# Altium project CONTROLLER_30.PrjPcb (part 2 of 3)

## Sheet PIC_POWER_MISC.SchDoc
size A3; ApprovedBy: D. Grossman; CheckedBy: G. Engel; Author: Y. Yakov; CompanyName: LightSense; DrawnBy: Y. Yakov; Engineer: Y.Yakov; Organization: LightSense
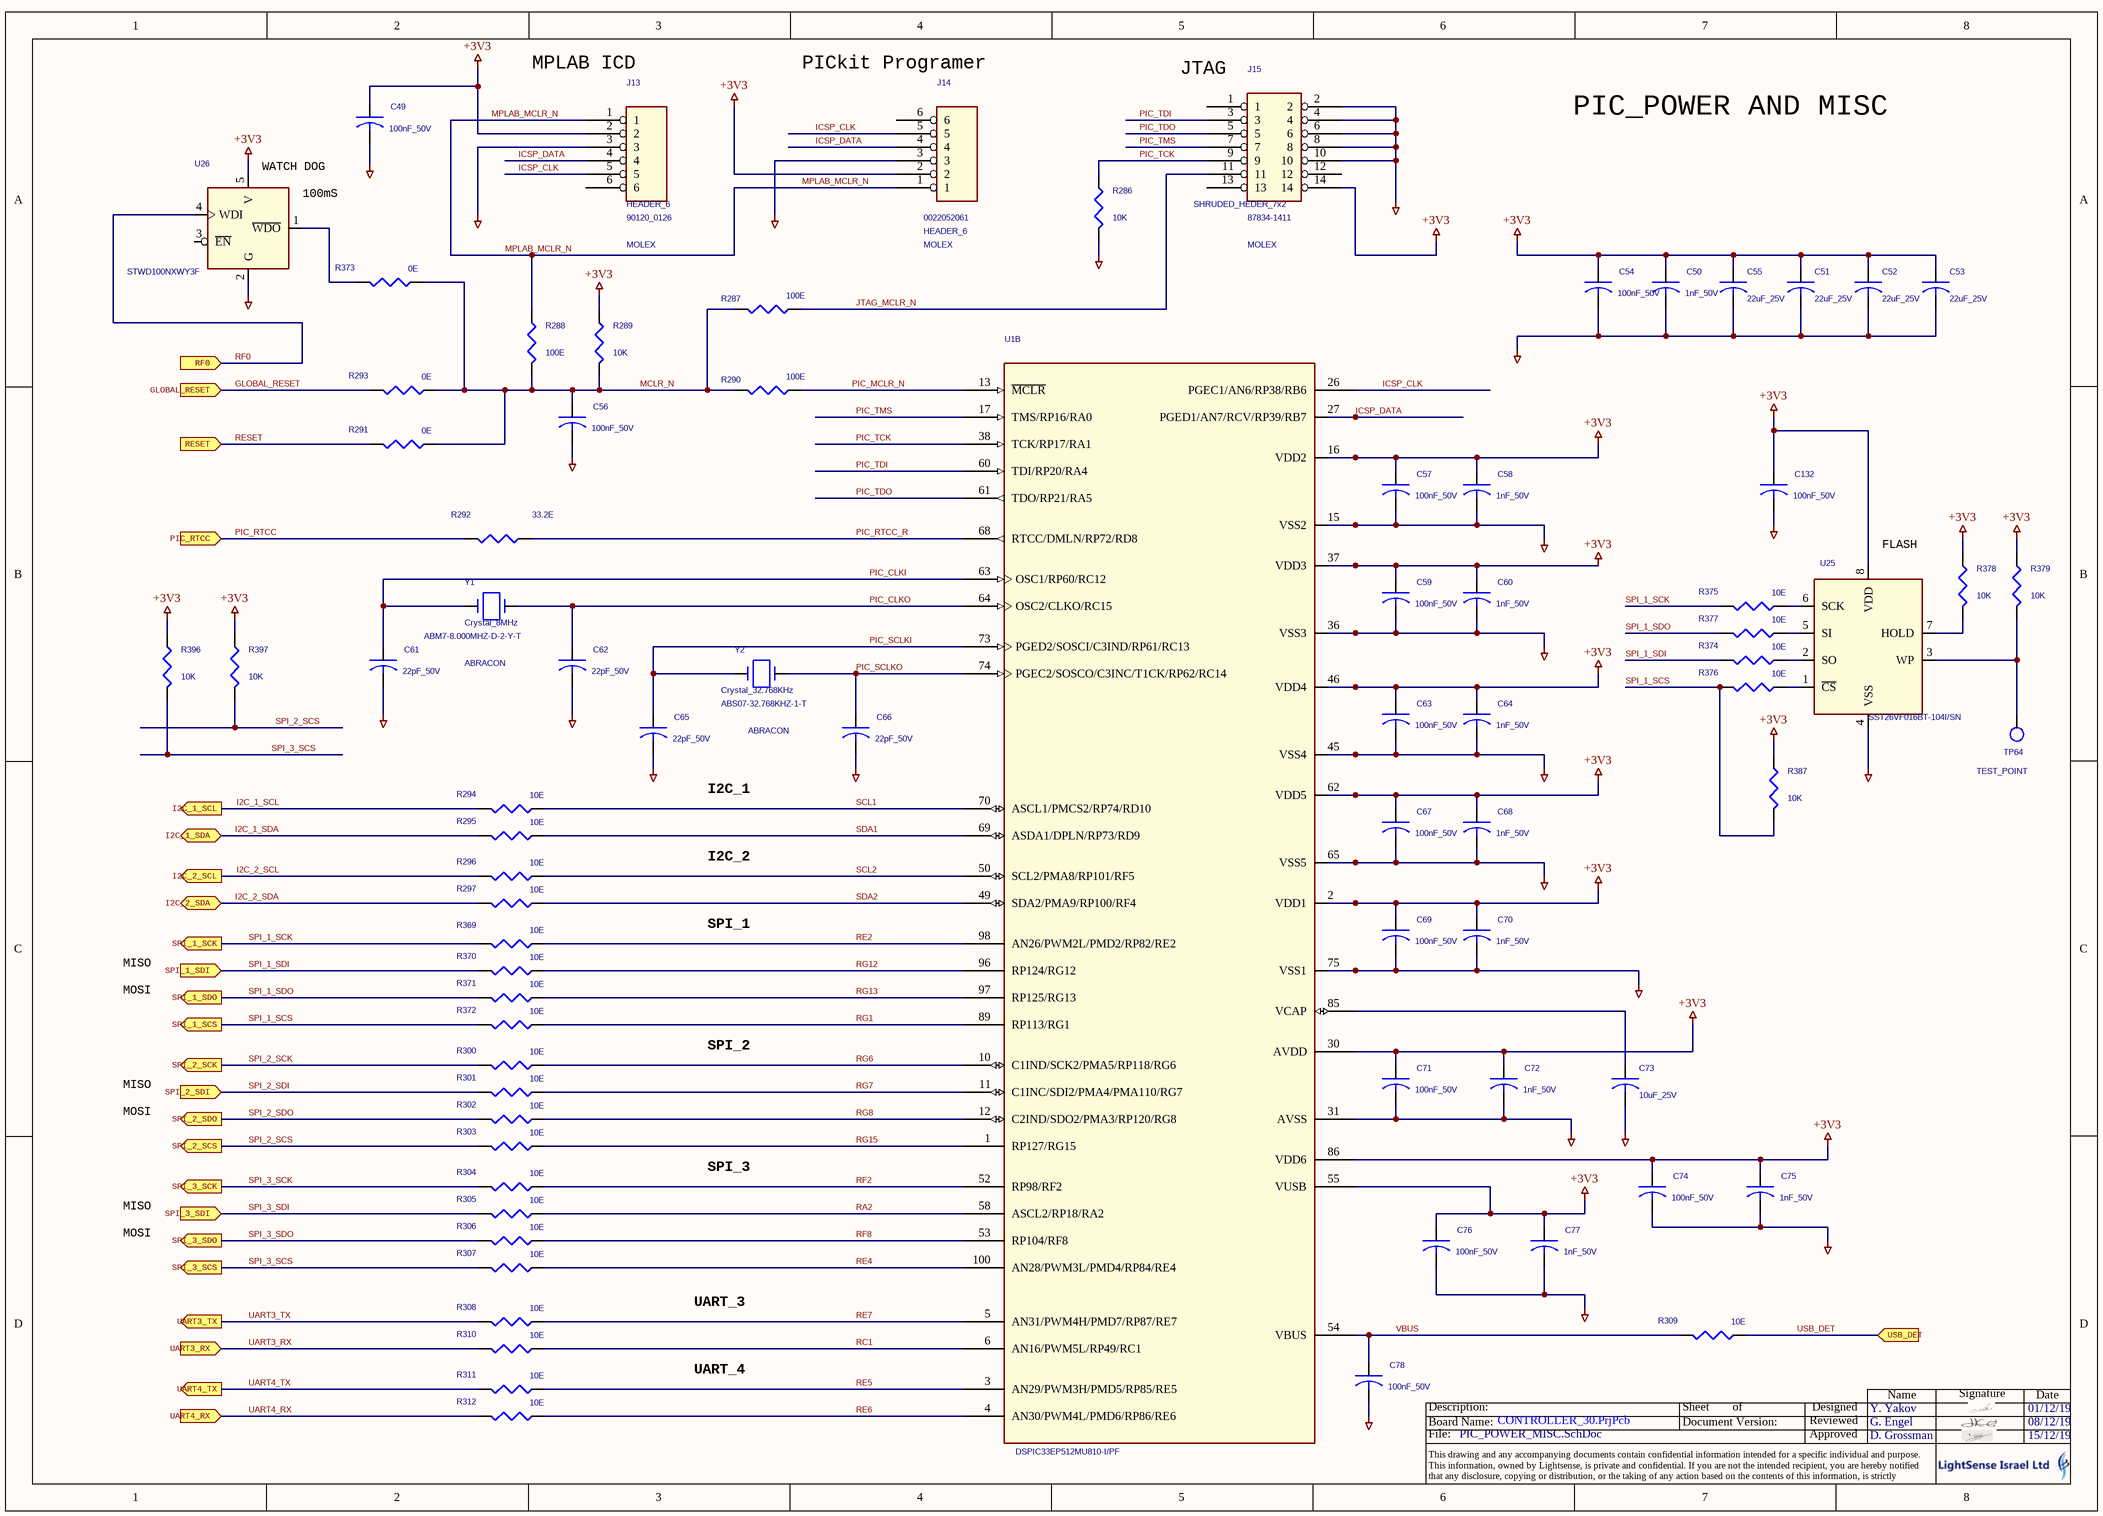
[diagram p13: PIC_POWER_MISC.SchDoc]

### Parts
C49  100nF_50V  [0603]
C50  1nF_50V  [0603]
C51  22uF_25V  [1210]
C52  22uF_25V  [1210]
C53  22uF_25V  [1210]
C54  100nF_50V  [0603]
C55  22uF_25V  [1210]
C56  100nF_50V  [0603]
C57  100nF_50V  [0603]
C58  1nF_50V  [0603]
C59  100nF_50V  [0603]
C60  1nF_50V  [0603]
C61  22pF_50V  [0603]
C62  22pF_50V  [0603]
C63  100nF_50V  [0603]
C64  1nF_50V  [0603]
C65  22pF_50V  [0603]
C66  22pF_50V  [0603]
C67  100nF_50V  [0603]
C68  1nF_50V  [0603]
C69  100nF_50V  [0603]
C70  1nF_50V  [0603]
C71  100nF_50V  [0603]
C72  1nF_50V  [0603]
C73  10uF_25V  [1206]
C74  100nF_50V  [0603]
C75  1nF_50V  [0603]
C76  100nF_50V  [0603]
C77  1nF_50V  [0603]
C78  100nF_50V  [0603]
C132  100nF_50V  [0603]
J13  HEADER_6  MFG: MOLEX  MFG_PN: 90120_0126  [HEADER_6PIN_100mil]
J14  HEADER_6  MFG_PN: 0022052061  MFG: MOLEX  [HEADER_6PIN_100mil]
J15  SHRUDED_HEDER_7x2  MFG: MOLEX  MFG_PN: 87834-1411  [SH_HEAD_2x7PIN_100mil]
R286  10K  [0603]
R287  100E  [0603]
R288  100E  [0603]
R289  10K  [0603]
R290  100E  [0603]
R291  0E  [0603]
R292  33.2E  [0603]
R293  0E  [0603]
R294  10E  [0603]
R295  10E  [0603]
R296  10E  [0603]
R297  10E  [0603]
R300  10E  [0603]
R301  10E  [0603]
R302  10E  [0603]
R303  10E  [0603]
R304  10E  [0603]
R305  10E  [0603]
R306  10E  [0603]
R307  10E  [0603]
R308  10E  [0603]
R309  10E  [0603]
R310  10E  [0603]
R311  10E  [0603]
R312  10E  [0603]
R369  10E  [0603]
R370  10E  [0603]
R371  10E  [0603]
R372  10E  [0603]
R373  0E  [0603]
R374  10E  [0603]
R375  10E  [0603]
R376  10E  [0603]
R377  10E  [0603]
R378  10K  [0603]
R379  10K  [0603]
R387  10K  [0603]
R396  10K  [0603]
R397  10K  [0603]
TP64  TEST_POINT  [TH_1mm]
U1  DSPIC33EP512MU810-I/PF  [TQFP_100]  (part B of 2)
U25  SST26VF016BT-104I/SN  [SOIC_8]
U26  STWD100NXWY3F  [SOT_23_5]
Y1  Crystal_8MHz  MFG_PN: ABM7-8.000MHZ-D-2-Y-T  MFG: ABRACON  [ABM7_SMD_2PIN]
Y2  Crystal_32.768KHz  MFG: ABRACON  MFG_PN: ABS07-32.768KHZ-1-T  [ABS07_SMD_2PIN]

### Ports
GLOBAL_RESET (in), I2C_1_SCL (out), I2C_1_SDA (bidir), I2C_2_SCL (out), I2C_2_SDA (bidir), PIC_RTCC (in), RESET (in), RF0 (in), SPI_1_SCK (out), SPI_1_SCS (out), SPI_1_SDI (in), SPI_1_SDO (out), SPI_2_SCK (out), SPI_2_SCS (out), SPI_2_SDI (in), SPI_2_SDO (out), SPI_3_SCK (out), SPI_3_SCS (out), SPI_3_SDI (in), SPI_3_SDO (out), UART3_RX (in), UART3_TX (out), UART4_RX (in), UART4_TX (out), USB_DET (in)

### Nets
+3V3: C49.1 C50.1 C51.1 C52.1 C53.1 C54.1 C55.1 C57.1 C58.1 C59.1 C60.1 C63.1 C64.1 C67.1 C68.1 C69.1 C70.1 C71.1 C72.1 C74.1 C75.1 C76.1 C77.1 C132.1 J13.2 J14.2 J15.14 R289.1 R378.1 R379.1 R387.1 R396.1 R397.1 U1.2(VDD1) U1.16(VDD2) U1.30(AVDD) U1.37(VDD3) U1.46(VDD4) U1.55(VUSB) U1.62(VDD5) U1.86(VDD6) U25.8(VDD) U26.5(V)
GND_CPU: C49.2 C50.2 C51.2 C52.2 C53.2 C54.2 C55.2 C56.2 C57.2 C58.2 C59.2 C60.2 C61.2 C62.2 C63.2 C64.2 C65.2 C66.2 C67.2 C68.2 C69.2 C70.2 C71.2 C72.2 C73.2 C74.2 C75.2 C76.2 C77.2 C78.2 C132.2 J13.3 J14.3 J15.2 J15.4 J15.6 J15.8 J15.10 R286.2 U1.15(VSS2) U1.31(AVSS) U1.36(VSS3) U1.45(VSS4) U1.65(VSS5) U1.75(VSS1) U25.4(VSS) U26.2(G)
GLOBAL_RESET: R293.2 ; port GLOBAL_RESET
I2C_1_SCL: R294.2 ; port I2C_1_SCL
I2C_1_SDA: R295.2 ; port I2C_1_SDA
I2C_2_SCL: R296.2 ; port I2C_2_SCL
I2C_2_SDA: R297.2 ; port I2C_2_SDA
ICSP_CLK: J13.5 J14.5 U1.26(PGEC1/AN6/RP38/RB6)
ICSP_DATA: J13.4 J14.4 U1.27(PGED1/AN7/RCV/RP39/RB7)
JTAG_MCLR_N: J15.11 R287.1
MCLR_N: C56.1 R287.2 R288.2 R289.2 R290.2 R291.1 R293.1 R373.1
MPLAB_MCLR_N: J13.1 J14.1 R288.1
PIC_CLKI: C61.1 U1.63(OSC1/RP60/RC12) Y1.1
PIC_CLKO: C62.1 U1.64(OSC2/CLKO/RC15) Y1.2
PIC_MCLR_N: R290.1 U1.13(~{MCLR})
PIC_RTCC: R292.2 ; port PIC_RTCC
PIC_RTCC_R: R292.1 U1.68(RTCC/DMLN/RP72/RD8)
PIC_SCLKI: C65.1 U1.73(PGED2/SOSCI/C3IND/RP61/RC13) Y2.1
PIC_SCLKO: C66.1 U1.74(PGEC2/SOSCO/C3INC/T1CK/RP62/RC14) Y2.2
PIC_TCK: J15.9 R286.1 U1.38(TCK/RP17/RA1)
PIC_TDI: J15.3 U1.60(TDI/RP20/RA4)
PIC_TDO: J15.5 U1.61(TDO/RP21/RA5)
PIC_TMS: J15.7 U1.17(TMS/RP16/RA0)
RA2: R305.1 U1.58(ASCL2/RP18/RA2)
RC1: R310.1 U1.6(AN16/PWM5L/RP49/RC1)
RE2: R369.1 U1.98(AN26/PWM2L/PMD2/RP82/RE2)
RE4: R307.1 U1.100(AN28/PWM3L/PMD4/RP84/RE4)
RE5: R311.1 U1.3(AN29/PWM3H/PMD5/RP85/RE5)
RE6: R312.1 U1.4(AN30/PWM4L/PMD6/RP86/RE6)
RE7: R308.1 U1.5(AN31/PWM4H/PMD7/RP87/RE7)
RESET: R291.2 ; port RESET
RF0: U26.4(WDI) ; port RF0
RF2: R304.1 U1.52(RP98/RF2)
RF8: R306.1 U1.53(RP104/RF8)
RG1: R372.1 U1.89(RP113/RG1)
RG6: R300.1 U1.10(C1IND/SCK2/PMA5/RP118/RG6)
RG7: R301.1 U1.11(C1INC/SDI2/PMA4/PMA110/RG7)
RG8: R302.1 U1.12(C2IND/SDO2/PMA3/RP120/RG8)
RG12: R370.1 U1.96(RP124/RG12)
RG13: R371.1 U1.97(RP125/RG13)
RG15: R303.1 U1.1(RP127/RG15)
SCL1: R294.1 U1.70(ASCL1/PMCS2/RP74/RD10)
SCL2: R296.1 U1.50(SCL2/PMA8/RP101/RF5)
SDA1: R295.1 U1.69(ASDA1/DPLN/RP73/RD9)
SDA2: R297.1 U1.49(SDA2/PMA9/RP100/RF4)
SPI_1_SCK: R369.2 R375.2 ; port SPI_1_SCK
SPI_1_SCS: R372.2 R376.2 R387.2 ; port SPI_1_SCS
SPI_1_SDI: R370.2 R374.2 ; port SPI_1_SDI
SPI_1_SDO: R371.2 R377.2 ; port SPI_1_SDO
SPI_2_SCK: R300.2 ; port SPI_2_SCK
SPI_2_SCS: R303.2 R397.2 ; port SPI_2_SCS
SPI_2_SDI: R301.2 ; port SPI_2_SDI
SPI_2_SDO: R302.2 ; port SPI_2_SDO
SPI_3_SCK: R304.2 ; port SPI_3_SCK
SPI_3_SCS: R307.2 R396.2 ; port SPI_3_SCS
SPI_3_SDI: R305.2 ; port SPI_3_SDI
SPI_3_SDO: R306.2 ; port SPI_3_SDO
UART3_RX: R310.2 ; port UART3_RX
UART3_TX: R308.2 ; port UART3_TX
UART4_RX: R312.2 ; port UART4_RX
UART4_TX: R311.2 ; port UART4_TX
USB_DET: R309.1 ; port USB_DET
VBUS: C78.1 R309.2 U1.54(VBUS)
NetC73_1: C73.1 U1.85(VCAP)
NetR373_2: R373.2 U26.1(~{WDO})
NetR374_1: R374.1 U25.2(SO)
NetR375_1: R375.1 U25.6(SCK)
NetR376_1: R376.1 U25.1(~{CS})
NetR377_1: R377.1 U25.5(SI)
NetR378_2: R378.2 U25.7(HOLD)
NetR379_2: R379.2 TP64.1(TP) U25.3(WP)

Not connected (* = marked no-connect by the designer): J13 6; J14 6; J15 1 12 13; U26 3(~{EN})

### Notes on the sheet
- (near J13) MPLAB ICD
- (near J14) PICkit Programer
- (near J15) JTAG
- PIC_POWER AND MISC
- (near U26) WATCH DOG
- (near U26) 100mS
- (near U25) FLASH
- I2C_1
- I2C_2
- SPI_1
- MISO
- MOSI
- SPI_2
- SPI_3
- UART_3
- UART_4
- Name
- Signature
- Date
- File:
- Board Name:
- Description:
- Document Version:
- Sheet
- of
- Approved
- Reviewed
- Designed
- This drawing and any accompanying documents contain confidential information intended for a specific individual and purpose.
  This information, owned by Lightsense, is private and confidential. If you are not the intended recipient, you are hereby notified that any disclosure, copying or distribution, or the taking of any action based on the contents of this information, is strictly prohibited.

### Library data of the parts
C49 C56 C57 C59 C63 C67 C69 C74 C78 C132 = C: as C113 on sheet USB
C50 C72 C77 = C: CAP_SMT_0603_50V_X7R_10%; MFG_PN: C0603C102K5RAC; MFG: KEMET
C51 C52 C55 = C: CAP_SMT_1210_25V_X7R_10%; MFG_PN: C1210C226K3RAC; MFG: KEMET
C53 = C: CAP_SMT_1210_25V_X7R_10%; MFG: KEMET; MFG_PN: C1210C226K3RAC
C54 C71 C76 = C: as C114 on sheet USB
C58 C60 C64 C68 C70 C75 = C: CAP_SMT_0603_50V_X7R_10%; MFG: KEMET; MFG_PN: C0603C102K5RAC
C61 C65 C66 = C: CAP_SMT_0603_50V_COG_10%; MFG: KEMET; MFG_PN: C0603C220K5GACTU
C62 = C: CAP_SMT_0603_50V_COG_10%; MFG_PN: C0603C220K5GACTU; MFG: KEMET
C73 = C: CAP_SMT_1206_25V_X7R_10%; MFG: KEMET; MFG_PN: C1206C106K3RAC
J13 J14 = HEADER 6
J15 = HEDER_7x2
R286 R378 R379 R387 R396 R397 = R_Dup1: MFG: YAGEO; MFG_PN: RC0603FR-0710K0L
R287 R288 R290 = R_Dup1: MFG: YAGEO; MFG_PN: RC0603FR-07100RL
R289 = R_Dup1: MFG_PN: RC0603FR-0710K0L; MFG: YAGEO
R291 R373 = R_Dup1: MFG_PN: RC0603FR-070R00L; MFG: YAGEO
R292 = R_Dup1: MFG: YAGEO; MFG_PN: RC0603FR-0733R2L
R293 = R_Dup1: MFG: YAGEO; MFG_PN: RC0603FR-070R00L
R294-R297 R300-R307 R309 R311 R312 R370-R372 R374 R376 R377 = R_Dup1: MFG: YAGEO; MFG_PN: RC0603FR-0710R0L
R308 R310 R369 R375 = R_Dup1: MFG_PN: RC0603FR-0710R0L; MFG: YAGEO
TP64 = T POINT R_Dup1
U1 = DSPIC33EP512MU810-I/PF_0: MFG: MICROCHIP; MFG_PN: DSPIC33EP512MU810-I/PF
U25 = SST26VF016BT-104I/SN: MFG: MICROCHIP; MFG_PN: SST26VF016BT-104I/SN
U26 = STWD100NXWY3F: WATCHDOG_100ms_SOT_23_5; MFG: ST; MFG_PN: STWD100NXWY3F
Y1 Y2 = Quartz

## Sheet ANALOG_INPUT.SchDoc
size A3; ApprovedBy: D. Grossman; CheckedBy: G. Engel; Author: Y. Yakov; CompanyName: LightSense; DrawnBy: Y. Yakov; Engineer: Y.Yakov; Organization: LightSense
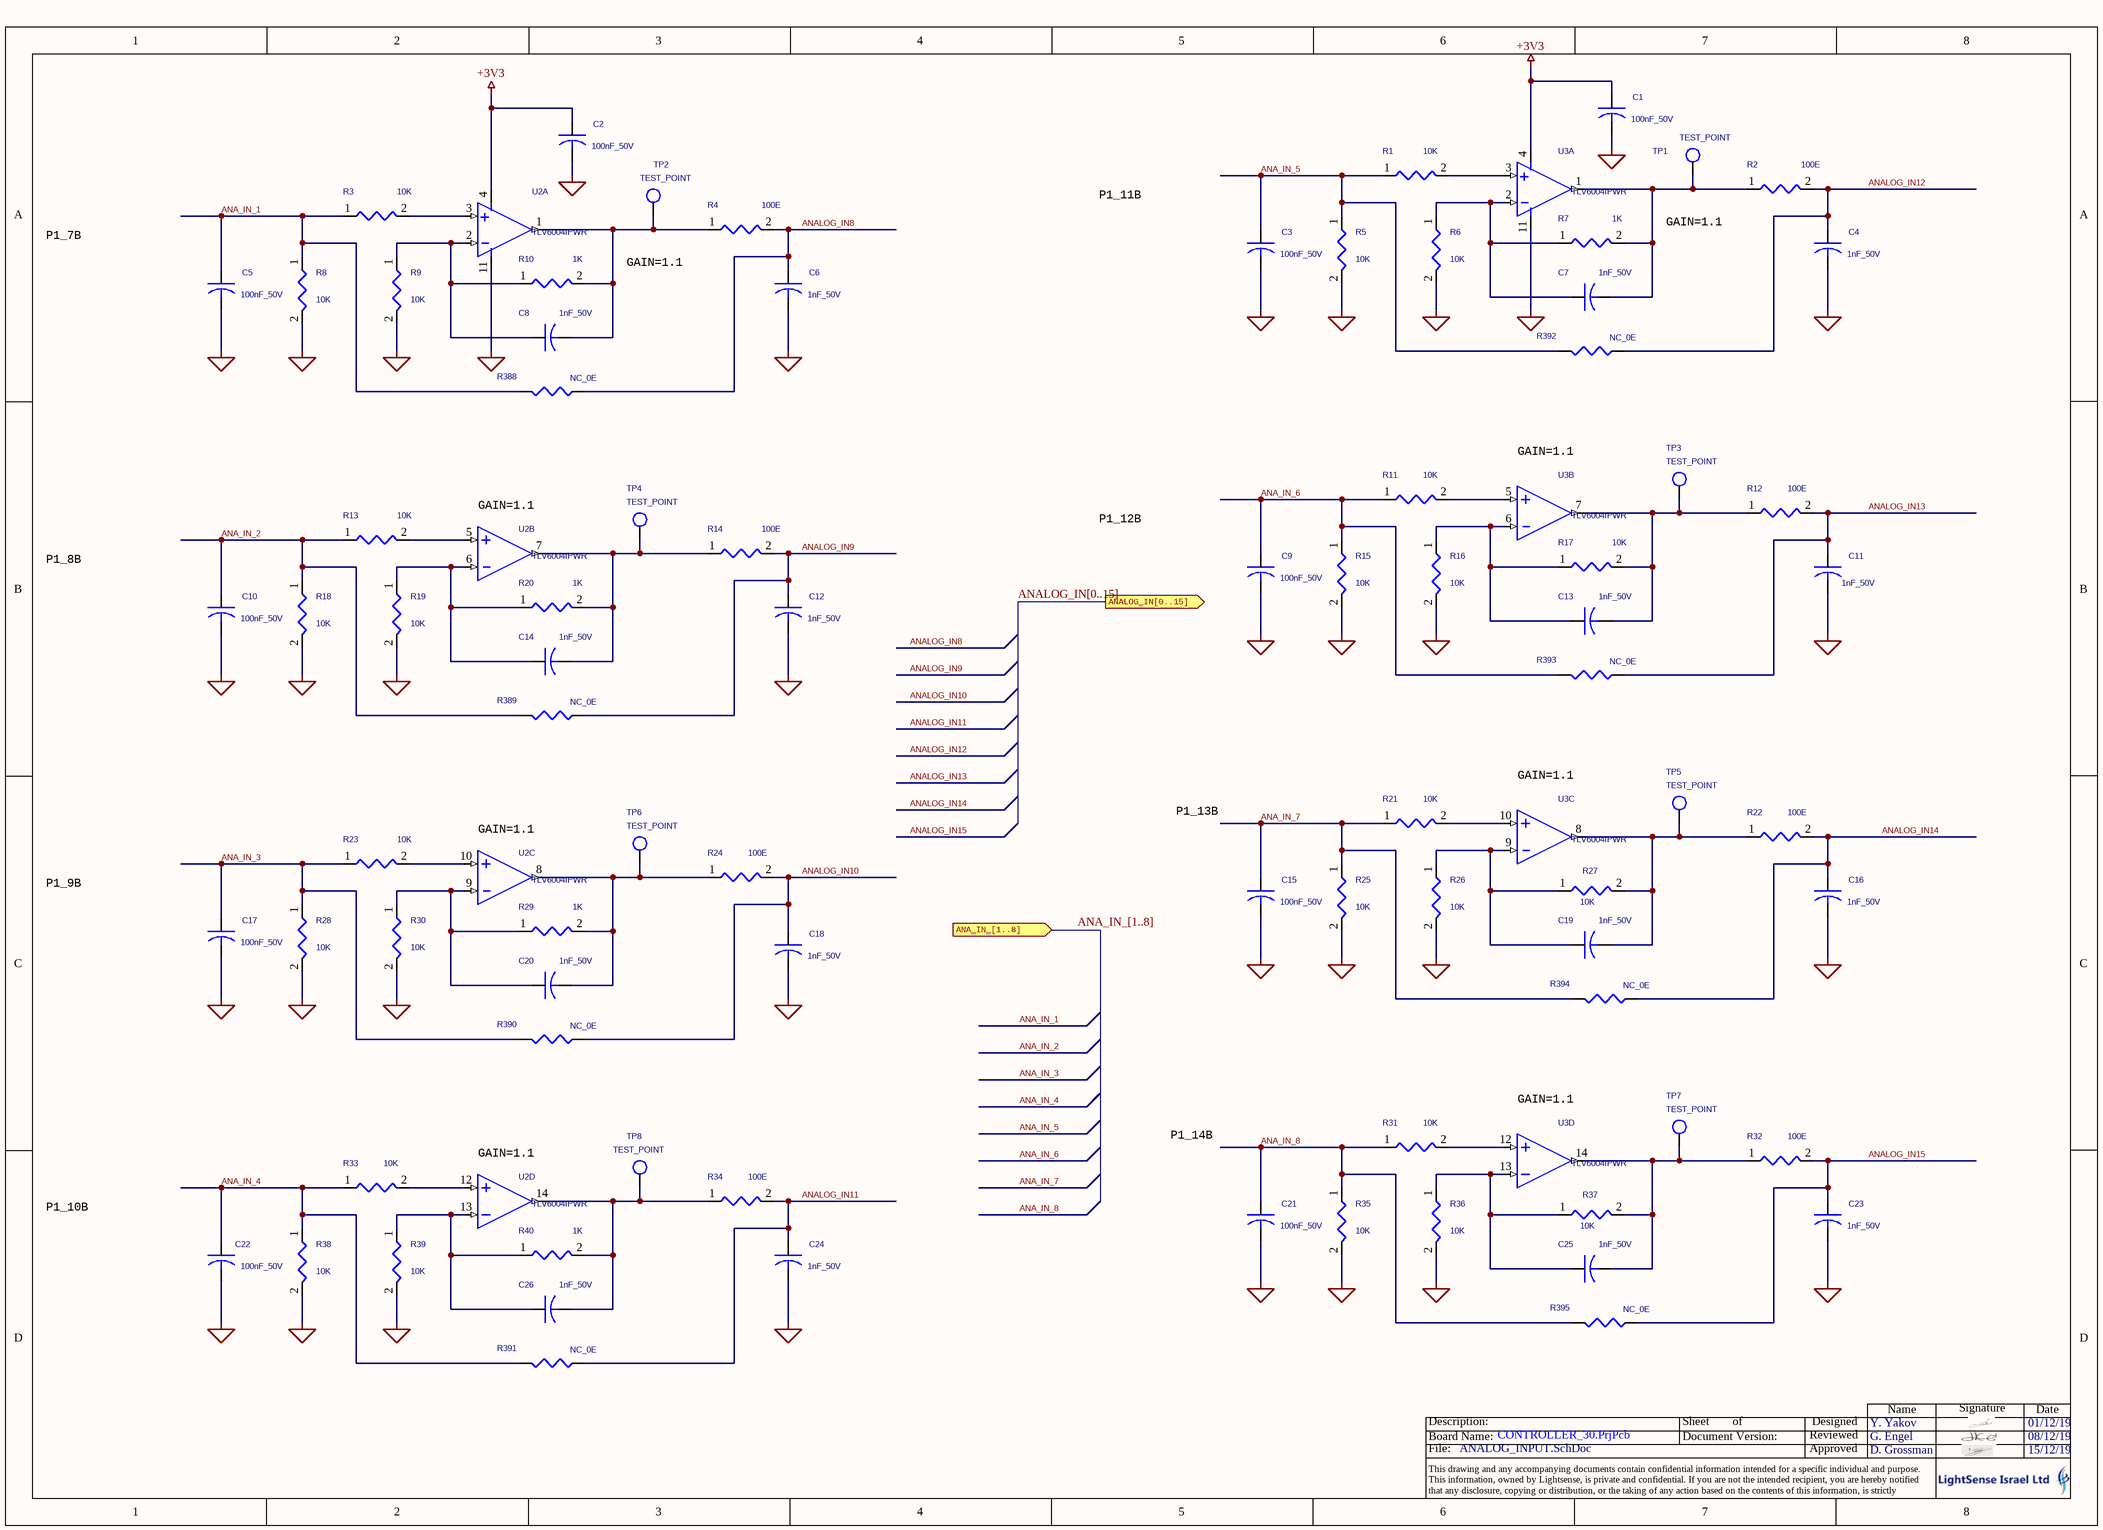
[diagram p14: ANALOG_INPUT.SchDoc]

### Parts
C1  100nF_50V  [0603]
C2  100nF_50V  [0603]
C3  100nF_50V  [0603]
C4  1nF_50V  [0603]
C5  100nF_50V  [0603]
C6  1nF_50V  [0603]
C7  1nF_50V  [0603]
C8  1nF_50V  [0603]
C9  100nF_50V  [0603]
C10  100nF_50V  [0603]
C11  1nF_50V  [0603]
C12  1nF_50V  [0603]
C13  1nF_50V  [0603]
C14  1nF_50V  [0603]
C15  100nF_50V  [0603]
C16  1nF_50V  [0603]
C17  100nF_50V  [0603]
C18  1nF_50V  [0603]
C19  1nF_50V  [0603]
C20  1nF_50V  [0603]
C21  100nF_50V  [0603]
C22  100nF_50V  [0603]
C23  1nF_50V  [0603]
C24  1nF_50V  [0603]
C25  1nF_50V  [0603]
C26  1nF_50V  [0603]
R1  10K  [0603]
R2  100E  [0603]
R3  10K  [0603]
R4  100E  [0603]
R5  10K  [0603]
R6  10K  [0603]
R7  1K  [0603]
R8  10K  [0603]
R9  10K  [0603]
R10  1K  [0603]
R11  10K  [0603]
R12  100E  [0603]
R13  10K  [0603]
R14  100E  [0603]
R15  10K  [0603]
R16  10K  [0603]
R17  10K  [0603]
R18  10K  [0603]
R19  10K  [0603]
R20  1K  [0603]
R21  10K  [0603]
R22  100E  [0603]
R23  10K  [0603]
R24  100E  [0603]
R25  10K  [0603]
R26  10K  [0603]
R27  10K  [0603]
R28  10K  [0603]
R29  1K  [0603]
R30  10K  [0603]
R31  10K  [0603]
R32  100E  [0603]
R33  10K  [0603]
R34  100E  [0603]
R35  10K  [0603]
R36  10K  [0603]
R37  10K  [0603]
R38  10K  [0603]
R39  10K  [0603]
R40  1K  [0603]
R388  NC_0E  [0603]
R389  NC_0E  [0603]
R390  NC_0E  [0603]
R391  NC_0E  [0603]
R392  NC_0E  [0603]
R393  NC_0E  [0603]
R394  NC_0E  [0603]
R395  NC_0E  [0603]
TP1  TEST_POINT  [TH_1mm]
TP2  TEST_POINT  [TH_1mm]
TP3  TEST_POINT  [TH_1mm]
TP4  TEST_POINT  [TH_1mm]
TP5  TEST_POINT  [TH_1mm]
TP6  TEST_POINT  [TH_1mm]
TP7  TEST_POINT  [TH_1mm]
TP8  TEST_POINT  [TH_1mm]
U2  TLV6004IPWR  [TSSOP_14]  (parts A,B,C,D of 4)
U3  TLV6004IPWR  [TSSOP_14]  (parts A,B,C,D of 4)

### Ports
ANA_IN_[1..8] (in), ANALOG_IN[0..15] (out)

### Nets
+3V3: C1.1 C2.1 U2.4(VCC) U3.4(VCC)
AGND: C1.2 C2.2 C3.2 C4.2 C5.2 C6.2 C9.2 C10.2 C11.2 C12.2 C15.2 C16.2 C17.2 C18.2 C21.2 C22.2 C23.2 C24.2 R5.2 R6.2 R8.2 R9.2 R15.2 R16.2 R18.2 R19.2 R25.2 R26.2 R28.2 R30.2 R35.2 R36.2 R38.2 R39.2 U2.11(VEE) U3.11(VEE)
ANA_IN_1: C5.1 R3.1 R8.1 R388.2
ANA_IN_2: C10.1 R13.1 R18.1 R389.2
ANA_IN_3: C17.1 R23.1 R28.1 R390.2
ANA_IN_4: C22.1 R33.1 R38.1 R391.2
ANA_IN_5: C3.1 R1.1 R5.1 R392.2
ANA_IN_6: C9.1 R11.1 R15.1 R393.2
ANA_IN_7: C15.1 R21.1 R25.1 R394.2
ANA_IN_8: C21.1 R31.1 R35.1 R395.2
ANALOG_IN8: C6.1 R4.2 R388.1
ANALOG_IN9: C12.1 R14.2 R389.1
ANALOG_IN10: C18.1 R24.2 R390.1
ANALOG_IN11: C24.1 R34.2 R391.1
ANALOG_IN12: C4.1 R2.2 R392.1
ANALOG_IN13: C11.1 R12.2 R393.1
ANALOG_IN14: C16.1 R22.2 R394.1
ANALOG_IN15: C23.1 R32.2 R395.1
NetC7_1: C7.1 R6.1 R7.1 U3.2(IAN)
NetC7_2: C7.2 R2.1 R7.2 TP1.1(TP) U3.1(OA)
NetC8_1: C8.1 R9.1 R10.1 U2.2(IAN)
NetC8_2: C8.2 R4.1 R10.2 TP2.1(TP) U2.1(OA)
NetC13_1: C13.1 R16.1 R17.1 U3.6(IBN)
NetC13_2: C13.2 R12.1 R17.2 TP3.1(TP) U3.7(OB)
NetC14_1: C14.1 R19.1 R20.1 U2.6(IBN)
NetC14_2: C14.2 R14.1 R20.2 TP4.1(TP) U2.7(OB)
NetC19_1: C19.1 R26.1 R27.1 U3.9(ICN)
NetC19_2: C19.2 R22.1 R27.2 TP5.1(TP) U3.8(OC)
NetC20_1: C20.1 R29.1 R30.1 U2.9(ICN)
NetC20_2: C20.2 R24.1 R29.2 TP6.1(TP) U2.8(OC)
NetC25_1: C25.1 R36.1 R37.1 U3.13(IDN)
NetC25_2: C25.2 R32.1 R37.2 TP7.1(TP) U3.14(OD)
NetC26_1: C26.1 R39.1 R40.1 U2.13(IDN)
NetC26_2: C26.2 R34.1 R40.2 TP8.1(TP) U2.14(OD)
NetR1_2: R1.2 U3.3(IAP)
NetR3_2: R3.2 U2.3(IAP)
NetR11_2: R11.2 U3.5(IBP)
NetR13_2: R13.2 U2.5(IBP)
NetR21_2: R21.2 U3.10(ICP)
NetR23_2: R23.2 U2.10(ICP)
NetR31_2: R31.2 U3.12(IDP)
NetR33_2: R33.2 U2.12(IDP)

### Buses and harness runs
bus ANA_IN_[1..8] = port ANA_IN_[1..8]
bus ANALOG_IN[0..15] = port ANALOG_IN[0..15]

### Notes on the sheet
- P1_11B
- P1_7B
- GAIN=1.1
- (near U3) GAIN=1.1
- (near U2) GAIN=1.1
- P1_12B
- P1_8B
- P1_13B
- P1_9B
- P1_14B
- P1_10B
- Name
- Signature
- Date
- File:
- Board Name:
- Description:
- Document Version:
- Sheet
- of
- Approved
- Reviewed
- Designed
- This drawing and any accompanying documents contain confidential information intended for a specific individual and purpose.
  This information, owned by Lightsense, is private and confidential. If you are not the intended recipient, you are hereby notified that any disclosure, copying or distribution, or the taking of any action based on the contents of this information, is strictly prohibited.

### Library data of the parts
C1 C5 C22 = C: CAP_SMT_0603_50V_X7R_10%; MFG: KEMET; MFG_PN: C0603C104K5RAC
C2 C3 C9 C10 C15 C17 C21 = C: CAP_SMT_0603_50V_X7R_10%; MFG_PN: C0603C104K5RAC; MFG: KEMET
C4 C6-C8 C12 C13 C16 C19 C20 C23-C25 = C: CAP_SMT_0603_50V_X7R_10%; MFG: KEMET; MFG_PN: C0603C102K5RAC
C11 C14 C18 C26 = C: CAP_SMT_0603_50V_X7R_10%; MFG_PN: C0603C102K5RAC; MFG: KEMET
R1-R26 R28-R36 R38-R40 = R_Dup2: MFG: YAGEO; MFG_PN: RC0603FR-07  KL
R27 R37 = R_Dup2: MFG_PN: RC0603FR-07  KL; MFG: YAGEO
R388 R390 R391 R394 R395 = R_Dup1: MFG_PN: RC0603FR-070R00L; MFG: YAGEO
R389 R392 R393 = R_Dup1: MFG: YAGEO; MFG_PN: RC0603FR-070R00L
TP1-TP8 = T POINT R_Dup1
U2 U3 = TL6004IP: OP_AMP; MFG: TI; MFG_PN: TLV6004IPWR

## Sheet POWER.SchDoc
size A3; ApprovedBy: D. Grossman; CheckedBy: G. Engel; Author: Y. Yakov; CompanyName: LightSense; DrawnBy: Y. Yakov; Engineer: Y.Yakov; Organization: LightSense
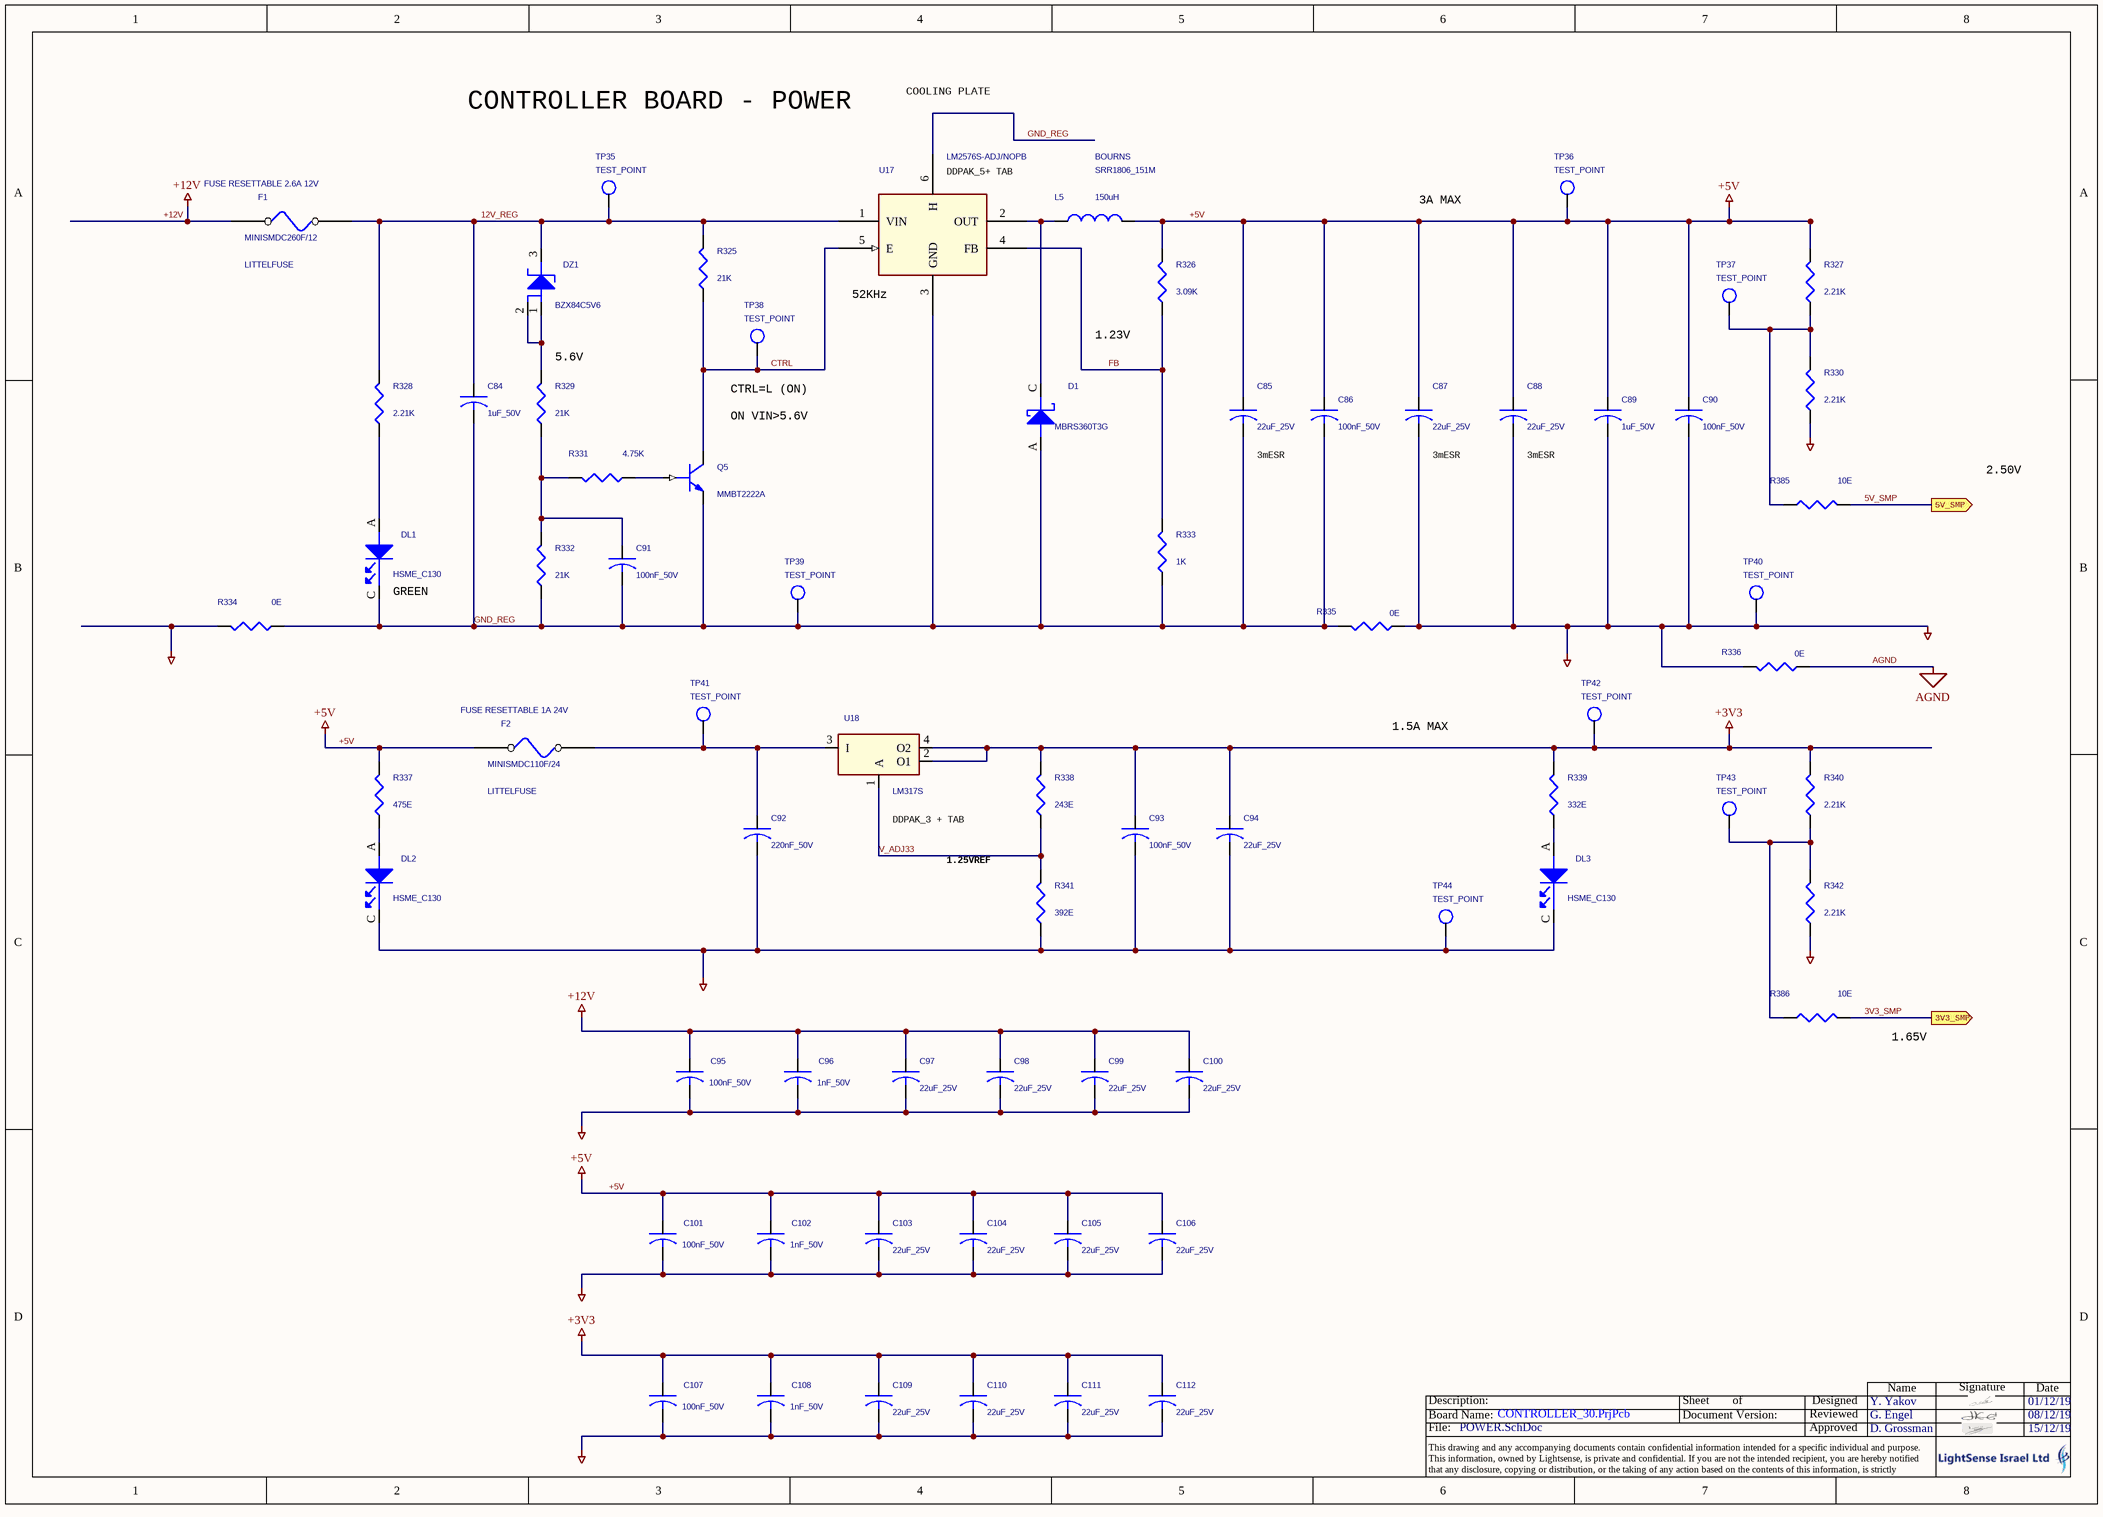
[diagram p15: POWER.SchDoc]

### Parts
C84  1uF_50V  [0805]
C85  22uF_25V  [1812]
C86  100nF_50V  [0603]
C87  22uF_25V  [1812]
C88  22uF_25V  [1812]
C89  1uF_50V  [0805]
C90  100nF_50V  [0603]
C91  100nF_50V  [0603]
C92  220nF_50V  [0603]
C93  100nF_50V  [0603]
C94  22uF_25V  [1210]
C95  100nF_50V  [0603]
C96  1nF_50V  [0603]
C97  22uF_25V  [1210]
C98  22uF_25V  [1210]
C99  22uF_25V  [1210]
C100  22uF_25V  [1210]
C101  100nF_50V  [0603]
C102  1nF_50V  [0603]
C103  22uF_25V  [1210]
C104  22uF_25V  [1210]
C105  22uF_25V  [1210]
C106  22uF_25V  [1210]
C107  100nF_50V  [0603]
C108  1nF_50V  [0603]
C109  22uF_25V  [1210]
C110  22uF_25V  [1210]
C111  22uF_25V  [1210]
C112  22uF_25V  [1210]
D1  MBRS360T3G  [SMC]
DL1  HSME_C130  [LED_0603]
DL2  HSME_C130  [LED_0603]
DL3  HSME_C130  [LED_0603]
DZ1  BZX84C5V6  [SOT_23]
F1  FUSE RESETTABLE 2.6A 12V  MFG: LITTELFUSE  MFG_PN: MINISMDC260F/12  [F1812]
F2  FUSE RESETTABLE 1A 24V  MFG_PN: MINISMDC110F/24  MFG: LITTELFUSE  [F1812]
L5  150uH  MFG: BOURNS  MFG_PN: SRR1806_151M  [SRR1806]
Q5  MMBT2222A  [SOT_23]
R325  21K  [0603]
R326  3.09K  [0603]
R327  2.21K  [0603]
R328  2.21K  [0603]
R329  21K  [0603]
R330  2.21K  [0603]
R331  4.75K  [0603]
R332  21K  [0603]
R333  1K  [0603]
R334  0E  [1812]
R335  0E  [1812]
R336  0E  [0805]
R337  475E  [0603]
R338  243E  [0603]
R339  332E  [0603]
R340  2.21K  [0603]
R341  392E  [0603]
R342  2.21K  [0603]
R385  10E  [0603]
R386  10E  [0603]
TP35  TEST_POINT  [TH_1mm]
TP36  TEST_POINT  [TH_1mm]
TP37  TEST_POINT  [TH_1mm]
TP38  TEST_POINT  [TH_1mm]
TP39  TEST_POINT  [TH_1mm]
TP40  TEST_POINT  [TH_1mm]
TP41  TEST_POINT  [TH_1mm]
TP42  TEST_POINT  [TH_1mm]
TP43  TEST_POINT  [TH_1mm]
TP44  TEST_POINT  [TH_1mm]
U17  LM2576S-ADJ/NOPB  [TO_263_6]
U18  LM317S  [TO_263_4]

### Ports
3V3_SMP (out), 5V_SMP (out)

### Nets
+3V3: C93.1 C94.1 C107.1 C108.1 C109.1 C110.1 C111.1 C112.1 R338.2 R339.2 R340.2 TP42.1(TP) U18.2(O1) U18.4(O2)
+5V: C85.1 C86.1 C87.1 C88.1 C89.1 C90.1 C101.1 C102.1 C103.1 C104.1 C105.1 C106.1 F2.1 L5.2 R326.2 R327.2 R337.2 TP36.1(TP)
+12V: C95.1 C96.1 C97.1 C98.1 C99.1 C100.1 F1.1
AGND: R336.1
GND_CPU: C87.2 C88.2 C89.2 C90.2 C92.2 C93.2 C94.2 C101.2 C102.2 C103.2 C104.2 C105.2 C106.2 C107.2 C108.2 C109.2 C110.2 C111.2 C112.2 DL2.C(CATHODE) DL3.C(CATHODE) R330.1 R335.1 R336.2 R341.1 R342.1 TP40.1(TP) TP44.1(TP)
GND_M: C95.2 C96.2 C97.2 C98.2 C99.2 C100.2 R334.2
3V3_SMP: R386.2 ; port 3V3_SMP
5V_SMP: R385.2 ; port 5V_SMP
12V_REG: C84.1 DZ1.3(CATHODE) F1.2 R325.2 R328.2 TP35.1(TP) U17.1(VIN)
CTRL: Q5.3(COLLECTOR) R325.1 TP38.1(TP) U17.5(E)
FB: R326.1 R333.2 U17.4(FB)
GND_REG: C84.2 C85.2 C86.2 C91.2 D1.A DL1.C(CATHODE) Q5.2(EMITTER) R332.1 R333.1 R334.1 R335.2 TP39.1(TP) U17.3(GND) U17.6(H)
V_ADJ33: R338.1 R341.2 U18.1(A)
NetC91_1: C91.1 R329.1 R331.2 R332.2
NetC92_1: C92.1 F2.2 TP41.1(TP) U18.3(I)
NetD1_C: D1.C L5.1 U17.2(OUT)
NetDL1_A: DL1.A(ANODE) R328.1
NetDL2_A: DL2.A(ANODE) R337.1
NetDL3_A: DL3.A(ANODE) R339.1
NetDZ1_1: DZ1.1(ANODE_1) DZ1.2(Anode_2) R329.2
NetQ5_1: Q5.1(BASE) R331.1
NetR327_1: R327.1 R330.2 R385.1 TP37.1(TP)
NetR340_1: R340.1 R342.2 R386.1 TP43.1(TP)

### Notes on the sheet
- CONTROLLER BOARD - POWER
- COOLING PLATE
- (near U17) DDPAK_5+ TAB
- 3A MAX
- (near U17) 52KHz
- (near R329) 5.6V
- (near R326) 1.23V
- (near TP38) CTRL=L (ON)
- ON VIN>5.6V
- (near C85) 3mESR
- (near C87) 3mESR
- (near C88) 3mESR
- 2.50V
- (near DL1) GREEN
- 1.5A MAX
- (near U18) DDPAK_3 + TAB
- 1.25VREF
- 1.65V
- Name
- Signature
- Date
- File:
- Board Name:
- Description:
- Document Version:
- Sheet
- of
- Approved
- Reviewed
- Designed
- This drawing and any accompanying documents contain confidential information intended for a specific individual and purpose.
  This information, owned by Lightsense, is private and confidential. If you are not the intended recipient, you are hereby notified that any disclosure, copying or distribution, or the taking of any action based on the contents of this information, is strictly prohibited.

### Library data of the parts
C84 C89 = CAP: a; Mnfctr_Part_Number: TCJT106M016R0150; MFG: Murata; MFG_PN: GRM21BR60J106K
C85 C87 C88 = CAP: a; MFG: TDK; MFG_PN: C4532X7R1E226M
C86 C101 C107 = C: as C2 on sheet ANALOG_INPUT
C90 C91 C93 C95 = C: as C1 on sheet ANALOG_INPUT
C92 = C: CAP_SMT_0603_50V_X7R_10%; MFG: TDK; MFG_PN: C1608X7R1H224K080AB
C94 C97-C100 C104-C106 C109 C110 C112 = C: CAP_SMT_1210_25V_X7R_10%; MFG_PN: C1210C226K3RAC; MFG: KEMET
C96 = C: as C4 on sheet ANALOG_INPUT
C102 C108 = C: as C11 on sheet ANALOG_INPUT
C103 C111 = C: CAP_SMT_1210_25V_X7R_10%; MFG: KEMET; MFG_PN: C1210C226K3RAC
D1 = DIODE SCHOTTKY_2: MFG: ON; Lumenis_P/N: DE0000062; MFG_PN: MBRS360T3G
DL1 DL3 = LED: Lumenis_P/N: EL0000123; MFG: AVAGO; MFG_PN: HSME_C130
DL2 = LED: MFG: AVAGO; Lumenis_P/N: EL0000123; MFG_PN: HSME_C130
DZ1 = DIODE ZENER S23: MFG: DIODES; MFG_PN: BZX84C5V6
F1 F2 = FUSE: FUSE_2.6A_MINISMDC260F/12; P/N1: Littelfuse;0154005.DR
L5 = CHOKE
Q5 = MMBT2222A: MFG: ST; MFG_PN: MMBT2222A
R325 = R_Dup1: MFG_PN: RC0603FR-0721K0L; MFG: YAGEO
R326 = R_Dup1: MFG_PN: RC0603FR-073K09L; MFG: YAGEO
R327 R330 R340 = R_Dup1: MFG: YAGEO; MFG_PN: RC0603FR-072K21L
R328 R342 = R_Dup1: MFG_PN: RC0603FR-072K21L; MFG: YAGEO
R329 R332 = R_Dup1: MFG: YAGEO; MFG_PN: RC0603FR-0721K0L
R331 = R_Dup1: MFG: YAGEO; MFG_PN: RC0603FR-074K75L
R333 = R_Dup1: MFG: YAGEO; MFG_PN: RC0603FR-071K00L
R334 = R_Dup1: MFG_PN: CRCW25120000Z0EG; MFG: VISHAY
R335 = R_Dup1: MFG_PN: RC0603FR-070R00L; MFG: YAGEO
R336 = R_Dup1: MFG: YAGEO; MFG_PN: RC0603FR-070R00L
R337 = R_Dup1: MFG_PN: RC0603FR-07475EL; MFG: YAGEO
R338 = R_Dup1: MFG: YAGEO; MFG_PN: RC0603FR-07243RL
R339 = R_Dup1: MFG_PN: RC0603FR-07332RL; MFG: YAGEO
R341 = R_Dup1: MFG_PN: RC0603FR-07392RL; MFG: YAGEO
R385 R386 = R_Dup1: MFG: YAGEO; MFG_PN: RC0603FR-0710R0L
TP35-TP44 = T POINT R_Dup1
U17 = LM2576X/TO263_0: MFG: TI; MFG_PN: LM2576S-ADJ/NOPB
U18 = LM317EMP: MFG: NATIONAL; MFG_PN: LM317S

## Sheet I2C_CH2.SchDoc
size A3; ApprovedBy: D. Grossman; CheckedBy: G. Engel; Author: Y. Yakov; CompanyName: LightSense; DrawnBy: Y. Yakov; Engineer: Y.Yakov; Organization: LightSense
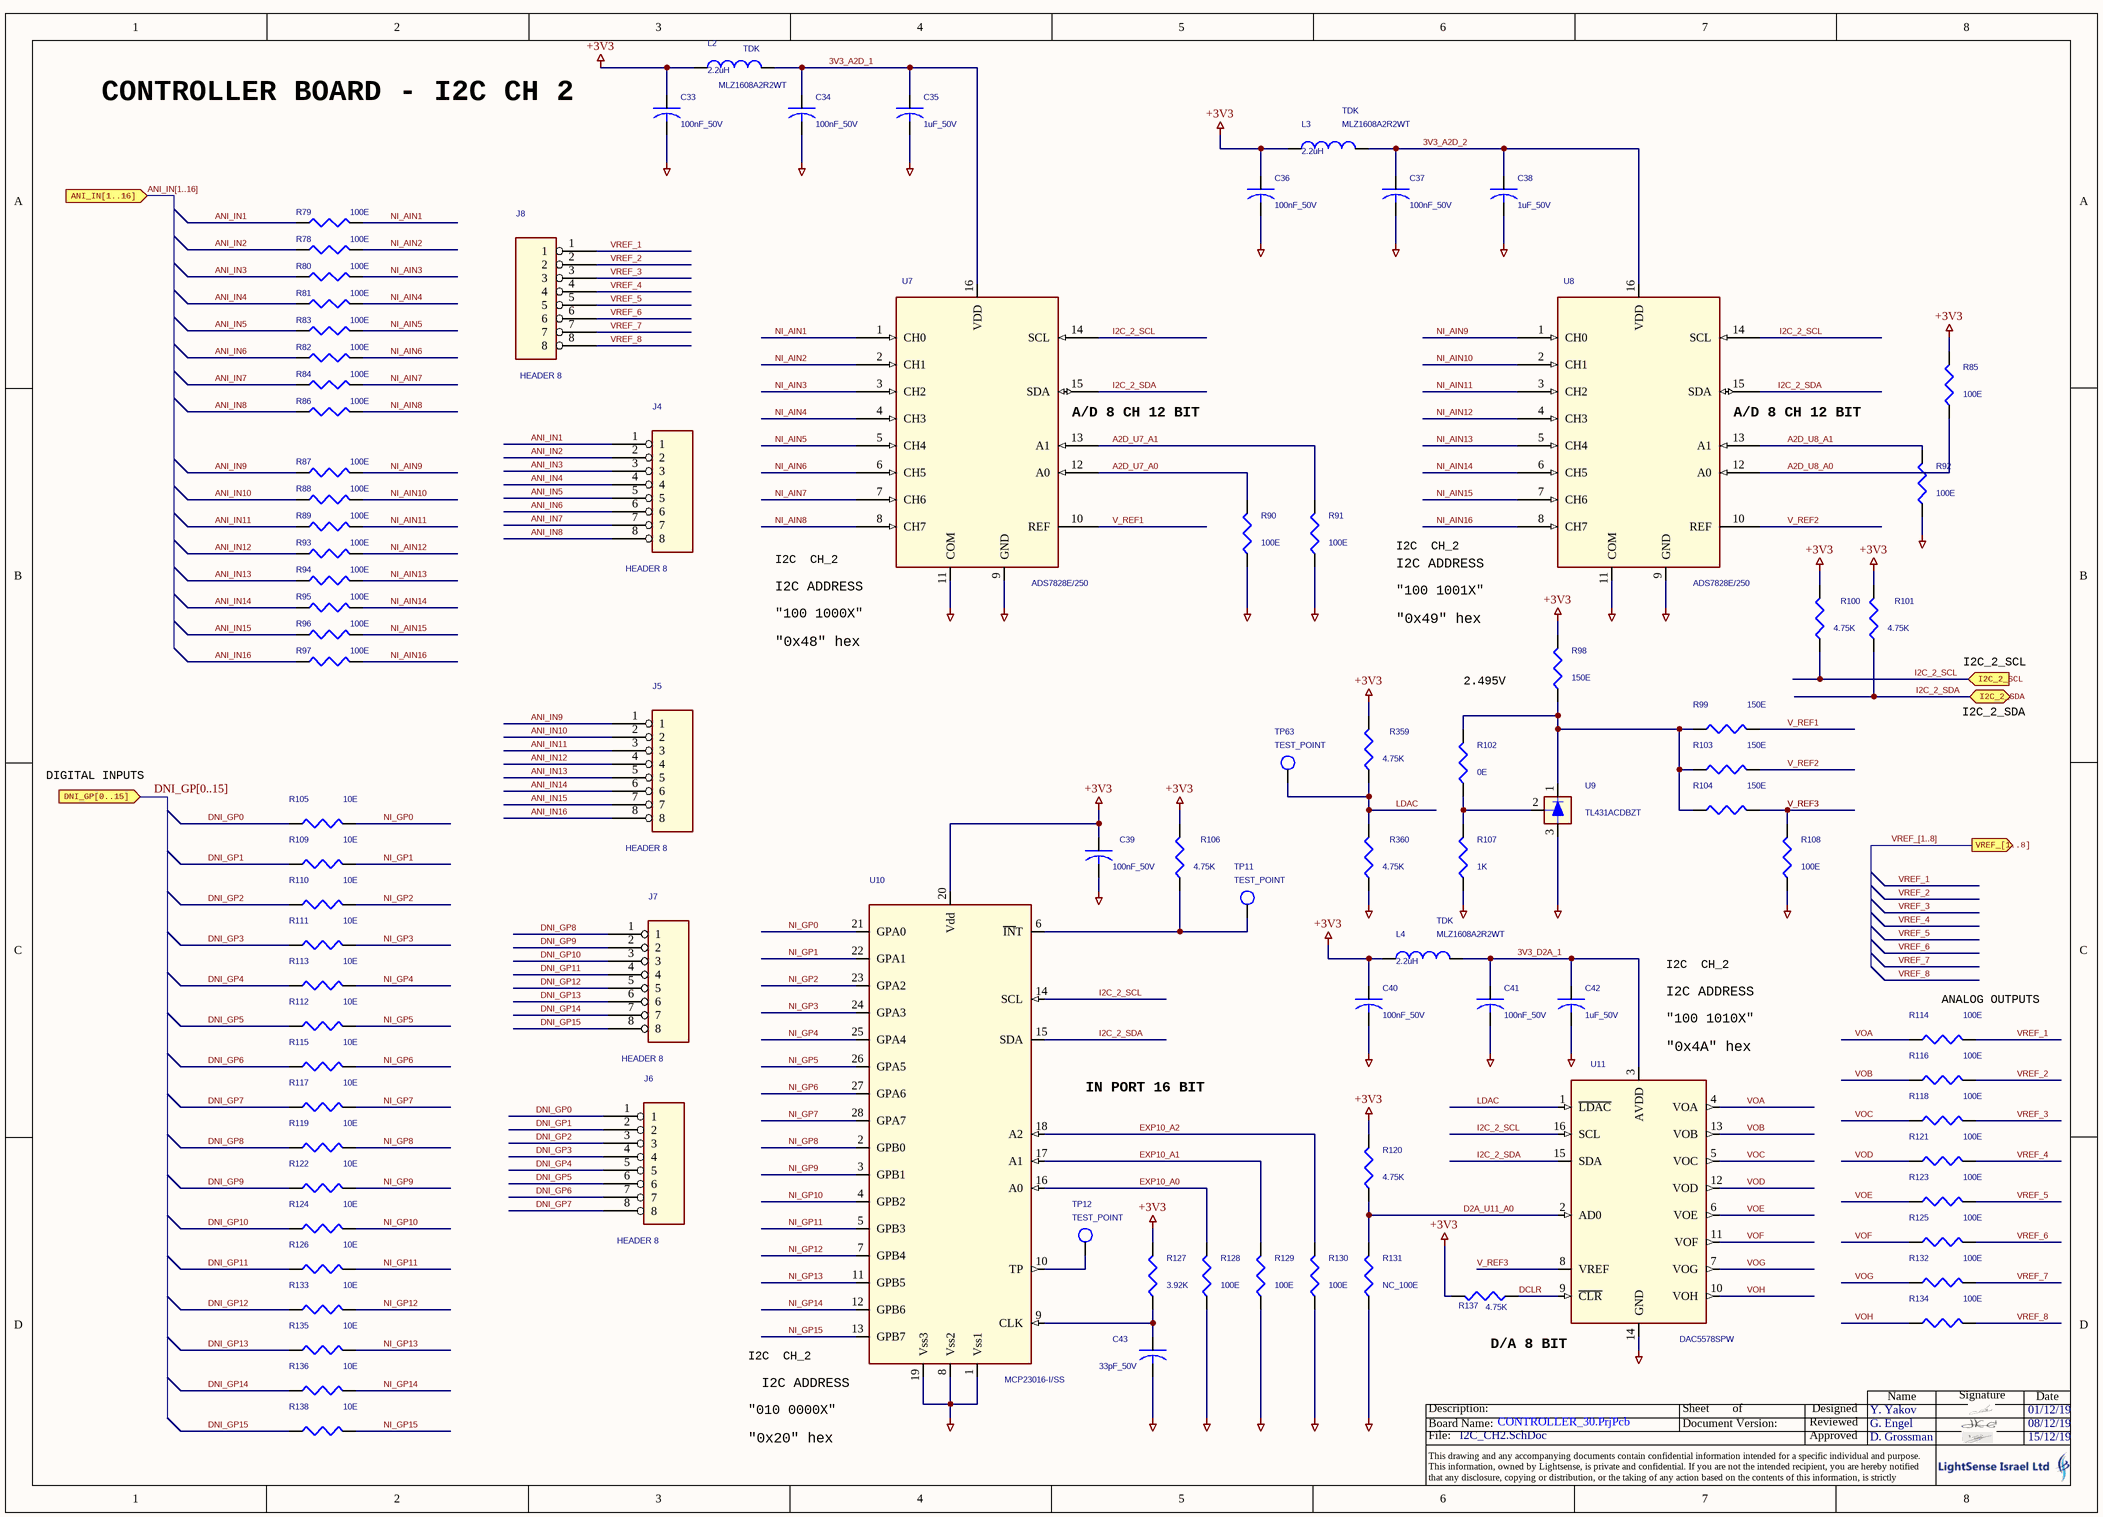
[diagram p16: I2C_CH2.SchDoc]

### Parts
C33  100nF_50V  [0603]
C34  100nF_50V  [0603]
C35  1uF_50V  [0805]
C36  100nF_50V  [0603]
C37  100nF_50V  [0603]
C38  1uF_50V  [0805]
C39  100nF_50V  [0603]
C40  100nF_50V  [0603]
C41  100nF_50V  [0603]
C42  1uF_50V  [0805]
C43  33pF_50V  [0603]
J4  HEADER 8  [TH_8PIN_100mil]
J5  HEADER 8  [TH_8PIN_100mil]
J6  HEADER 8  [TH_8PIN_100mil]
J7  HEADER 8  [TH_8PIN_100mil]
J8  HEADER 8  [TH_8PIN_100mil]
L2  2.2uH  MFG: TDK  MFG_PN: MLZ1608A2R2WT  [0603]
L3  2.2uH  MFG_PN: MLZ1608A2R2WT  MFG: TDK  [0603]
L4  2.2uH  MFG: TDK  MFG_PN: MLZ1608A2R2WT  [0603]
R78  100E  [0603]
R79  100E  [0603]
R80  100E  [0603]
R81  100E  [0603]
R82  100E  [0603]
R83  100E  [0603]
R84  100E  [0603]
R85  100E  [0603]
R86  100E  [0603]
R87  100E  [0603]
R88  100E  [0603]
R89  100E  [0603]
R90  100E  [0603]
R91  100E  [0603]
R92  100E  [0603]
R93  100E  [0603]
R94  100E  [0603]
R95  100E  [0603]
R96  100E  [0603]
R97  100E  [0603]
R98  150E  [0603]
R99  150E  [0603]
R100  4.75K  [0603]
R101  4.75K  [0603]
R102  0E  [0603]
R103  150E  [0603]
R104  150E  [0603]
R105  10E  [0603]
R106  4.75K  [0603]
R107  1K  [0603]
R108  100E  [0603]
R109  10E  [0603]
R110  10E  [0603]
R111  10E  [0603]
R112  10E  [0603]
R113  10E  [0603]
R114  100E  [0603]
R115  10E  [0603]
R116  100E  [0603]
R117  10E  [0603]
R118  100E  [0603]
R119  10E  [0603]
R120  4.75K  [0603]
R121  100E  [0603]
R122  10E  [0603]
R123  100E  [0603]
R124  10E  [0603]
R125  100E  [0603]
R126  10E  [0603]
R127  3.92K  [0603]
R128  100E  [0603]
R129  100E  [0603]
R130  100E  [0603]
R131  NC_100E  [0603]
R132  100E  [0603]
R133  10E  [0603]
R134  100E  [0603]
R135  10E  [0603]
R136  10E  [0603]
R137  4.75K  [0603]
R138  10E  [0603]
R359  4.75K  [0603]
R360  4.75K  [0603]
TP11  TEST_POINT  [TH_1mm]
TP12  TEST_POINT  [TH_1mm]
TP63  TEST_POINT  [TH_1mm]
U7  ADS7828E/250  [TSSOP_16]
U8  ADS7828E/250  [TSSOP_16]
U9  TL431ACDBZT  [SOT_23]
U10  MCP23016-I/SS  [SSOP_28]
U11  DAC5578SPW  [TSSOP_16]

### Ports
ANI_IN[1..16] (in), DNI_GP[0..15] (in), I2C_2_SCL (in), I2C_2_SDA (bidir), VREF_[1..8] (out)

### Nets
+3V3: C33.1 C36.1 C39.1 C40.1 L2.1 L3.1 L4.1 R85.2 R98.2 R100.2 R101.2 R106.2 R120.2 R127.2 R137.2 R359.2 U10.20(Vdd)
GND_CPU: C33.2 C34.2 C35.2 C36.2 C37.2 C38.2 C39.2 C40.2 C41.2 C42.2 C43.2 R90.1 R91.1 R92.1 R107.1 R108.1 R128.1 R129.1 R130.1 R131.1 R360.1 U7.9(GND) U7.11(COM) U8.9(GND) U8.11(COM) U9.3(ANODA) U10.1(Vss1) U10.8(Vss2) U10.19(Vss3) U11.14(GND)
3V3_A2D_1: C34.1 C35.1 L2.2 U7.16(VDD)
3V3_A2D_2: C37.1 C38.1 L3.2 U8.16(VDD)
3V3_D2A_1: C41.1 C42.1 L4.2 U11.3(AVDD)
A2D_U7_A0: R90.2 U7.12(A0)
A2D_U7_A1: R91.2 U7.13(A1)
A2D_U8_A0: R85.1 U8.12(A0)
A2D_U8_A1: R92.2 U8.13(A1)
ANI_IN1: J4.1 R79.2
ANI_IN2: J4.2 R78.2
ANI_IN3: J4.3 R80.2
ANI_IN4: J4.4 R81.2
ANI_IN5: J4.5 R83.2
ANI_IN6: J4.6 R82.2
ANI_IN7: J4.7 R84.2
ANI_IN8: J4.8 R86.2
ANI_IN9: J5.1 R87.2
ANI_IN10: J5.2 R88.2
ANI_IN11: J5.3 R89.2
ANI_IN12: J5.4 R93.2
ANI_IN13: J5.5 R94.2
ANI_IN14: J5.6 R95.2
ANI_IN15: J5.7 R96.2
ANI_IN16: J5.8 R97.2
D2A_U11_A0: R120.1 R131.2 U11.2(AD0)
DCLR: R137.1 U11.9(~{CLR})
DNI_GP0: J6.1 R105.2
DNI_GP1: J6.2 R109.2
DNI_GP2: J6.3 R110.2
DNI_GP3: J6.4 R111.2
DNI_GP4: J6.5 R113.2
DNI_GP5: J6.6 R112.2
DNI_GP6: J6.7 R115.2
DNI_GP7: J6.8 R117.2
DNI_GP8: J7.1 R119.2
DNI_GP9: J7.2 R122.2
DNI_GP10: J7.3 R124.2
DNI_GP11: J7.4 R126.2
DNI_GP12: J7.5 R133.2
DNI_GP13: J7.6 R135.2
DNI_GP14: J7.7 R136.2
DNI_GP15: J7.8 R138.2
EXP10_A0: R128.2 U10.16(A0)
EXP10_A1: R129.2 U10.17(A1)
EXP10_A2: R130.2 U10.18(A2)
I2C_2_SCL: R100.1 U7.14(SCL) U8.14(SCL) U10.14(SCL) U11.16(SCL) ; port I2C_2_SCL
I2C_2_SDA: R101.1 U7.15(SDA) U8.15(SDA) U10.15(SDA) U11.15(SDA) ; port I2C_2_SDA
LDAC: R359.1 R360.2 TP63.1(TP) U11.1(~{LDAC})
NI_AIN1: R79.1 U7.1(CH0)
NI_AIN2: R78.1 U7.2(CH1)
NI_AIN3: R80.1 U7.3(CH2)
NI_AIN4: R81.1 U7.4(CH3)
NI_AIN5: R83.1 U7.5(CH4)
NI_AIN6: R82.1 U7.6(CH5)
NI_AIN7: R84.1 U7.7(CH6)
NI_AIN8: R86.1 U7.8(CH7)
NI_AIN9: R87.1 U8.1(CH0)
NI_AIN10: R88.1 U8.2(CH1)
NI_AIN11: R89.1 U8.3(CH2)
NI_AIN12: R93.1 U8.4(CH3)
NI_AIN13: R94.1 U8.5(CH4)
NI_AIN14: R95.1 U8.6(CH5)
NI_AIN15: R96.1 U8.7(CH6)
NI_AIN16: R97.1 U8.8(CH7)
NI_GP0: R105.1 U10.21(GPA0)
NI_GP1: R109.1 U10.22(GPA1)
NI_GP2: R110.1 U10.23(GPA2)
NI_GP3: R111.1 U10.24(GPA3)
NI_GP4: R113.1 U10.25(GPA4)
NI_GP5: R112.1 U10.26(GPA5)
NI_GP6: R115.1 U10.27(GPA6)
NI_GP7: R117.1 U10.28(GPA7)
NI_GP8: R119.1 U10.2(GPB0)
NI_GP9: R122.1 U10.3(GPB1)
NI_GP10: R124.1 U10.4(GPB2)
NI_GP11: R126.1 U10.5(GPB3)
NI_GP12: R133.1 U10.7(GPB4)
NI_GP13: R135.1 U10.11(GPB5)
NI_GP14: R136.1 U10.12(GPB6)
NI_GP15: R138.1 U10.13(GPB7)
V_REF1: R99.1 U7.10(REF)
V_REF2: R103.1 U8.10(REF)
V_REF3: R104.1 R108.2 U11.8(VREF)
VOA: R114.2 U11.4(VOA)
VOB: R116.2 U11.13(VOB)
VOC: R118.2 U11.5(VOC)
VOD: R121.2 U11.12(VOD)
VOE: R123.2 U11.6(VOE)
VOF: R125.2 U11.11(VOF)
VOG: R132.2 U11.7(VOG)
VOH: R134.2 U11.10(VOH)
VREF_1: J8.1 R114.1
VREF_2: J8.2 R116.1
VREF_3: J8.3 R118.1
VREF_4: J8.4 R121.1
VREF_5: J8.5 R123.1
VREF_6: J8.6 R125.1
VREF_7: J8.7 R132.1
VREF_8: J8.8 R134.1
NetC43_1: C43.1 R127.1 U10.9(CLK)
NetR98_1: R98.1 R99.2 R102.2 R103.2 R104.2 U9.1(CAT)
NetR102_1: R102.1 R107.2 U9.2(Vref)
NetR106_1: R106.1 TP11.1(TP) U10.6(~{IN}T)
NetTP12_1: TP12.1(TP) U10.10(TP)

### Buses and harness runs
bus ANI_IN[1..16] = port ANI_IN[1..16]
bus DNI_GP[0..15] = port DNI_GP[0..15]
bus VREF_[1..8] = port VREF_[1..8]

### Notes on the sheet
- CONTROLLER BOARD - I2C CH 2
- (near U7) A/D 8 CH 12 BIT
- (near U8) A/D 8 CH 12 BIT
- (near U7) I2C ADDRESS
- I2C  CH_2
- I2C ADDRESS
- "100 1001X"
- "0x48" hex
- "100 1000X"
- "0x49" hex
- 2.495V
- I2C_2_SDA
- I2C_2_SCL
- DIGITAL INPUTS
- (near U11) "0x4A" hex
- (near U11) "100 1010X"
- (near R114) ANALOG OUTPUTS
- IN PORT 16 BIT
- (near U10) I2C ADDRESS
- (near U11) D/A 8 BIT
- "0x20" hex
- "010 0000X"
- Name
- Signature
- Date
- File:
- Board Name:
- Description:
- Document Version:
- Sheet
- of
- Approved
- Reviewed
- Designed
- This drawing and any accompanying documents contain confidential information intended for a specific individual and purpose.
  This information, owned by Lightsense, is private and confidential. If you are not the intended recipient, you are hereby notified that any disclosure, copying or distribution, or the taking of any action based on the contents of this information, is strictly prohibited.

### Library data of the parts
C33 C34 C40 = C: as C2 on sheet ANALOG_INPUT
C35 C38 C42 = CAP: as C84 on sheet POWER
C36 C37 C41 = C: as C1 on sheet ANALOG_INPUT
C39 = C: CAP_SMT_0603_50V_X7R_10%; MFG: KEMET; Lumenis_P/N: EC1691600; MFG_PN: C0603C104K5RAC
C43 = C: CAP_SMT_0603_50V_X7R_10%; MFG: KEMET; MFG_PN: C0603C330K5RAC
L2-L4 = INDUCTOR
R78 R79 R83 R91-R95 R114 R116 R118 R121 R123 R125 R128 R130-R132 R134 = R_Dup1: MFG: YAGEO; MFG_PN: RC0603FR-07100RL
R80-R82 R84-R90 R96 R97 R108 R129 = R_Dup1: MFG_PN: RC0603FR-07100RL; MFG: YAGEO
R98 R103 R104 = R_Dup1: MFG_PN: RC0603FR-07150RL; MFG: YAGEO
R99 = R_Dup1: MFG: YAGEO; MFG_PN: RC0603FR-07150RL
R100 R101 R106 R120 R360 = R_Dup1: MFG: YAGEO; MFG_PN: RC0603FR-074K75L
R102 = R_Dup1: MFG: YAGEO; MFG_PN: RC0603FR-070R00L
R105 R109-R113 R115 R117 R119 R122 R124 R126 R133 R135 R136 R138 = R_Dup1: MFG_PN: RC0603FR-0710R0L; MFG: YAGEO
R107 = R_Dup1: MFG_PN: RC0603FR-071K00L; MFG: YAGEO
R127 = R_Dup1: MFG_PN: RC0603FR-073K92L; MFG: YAGEO
R137 R359 = R_Dup1: MFG_PN: RC0603FR-074K75L; MFG: YAGEO
TP11 TP12 TP63 = T POINT R_Dup1
U7 U8 = ADS7828E: MFG: TI; MFG_PN: ADS7828E/250
U9 = TL431ACDBZT: Part_Number: <Part_Number>; MFG: TI; MFG_PN: TL431ACDBZT
U10 = MCP23016-I/SS: MFG: MICROCHIP; MFG_PN: MCP23016-I/SS
U11 = DAC5578SPW: MFG: TI; MFG_PN: DAC5578SPW

## Sheet I2C_CH3.SchDoc
size A3; ApprovedBy: D. Grossman; CheckedBy: G. Engel; Author: Y. Yakov; CompanyName: LightSense; DrawnBy: Y. Yakov; Engineer: Y.Yakov; Organization: LightSense
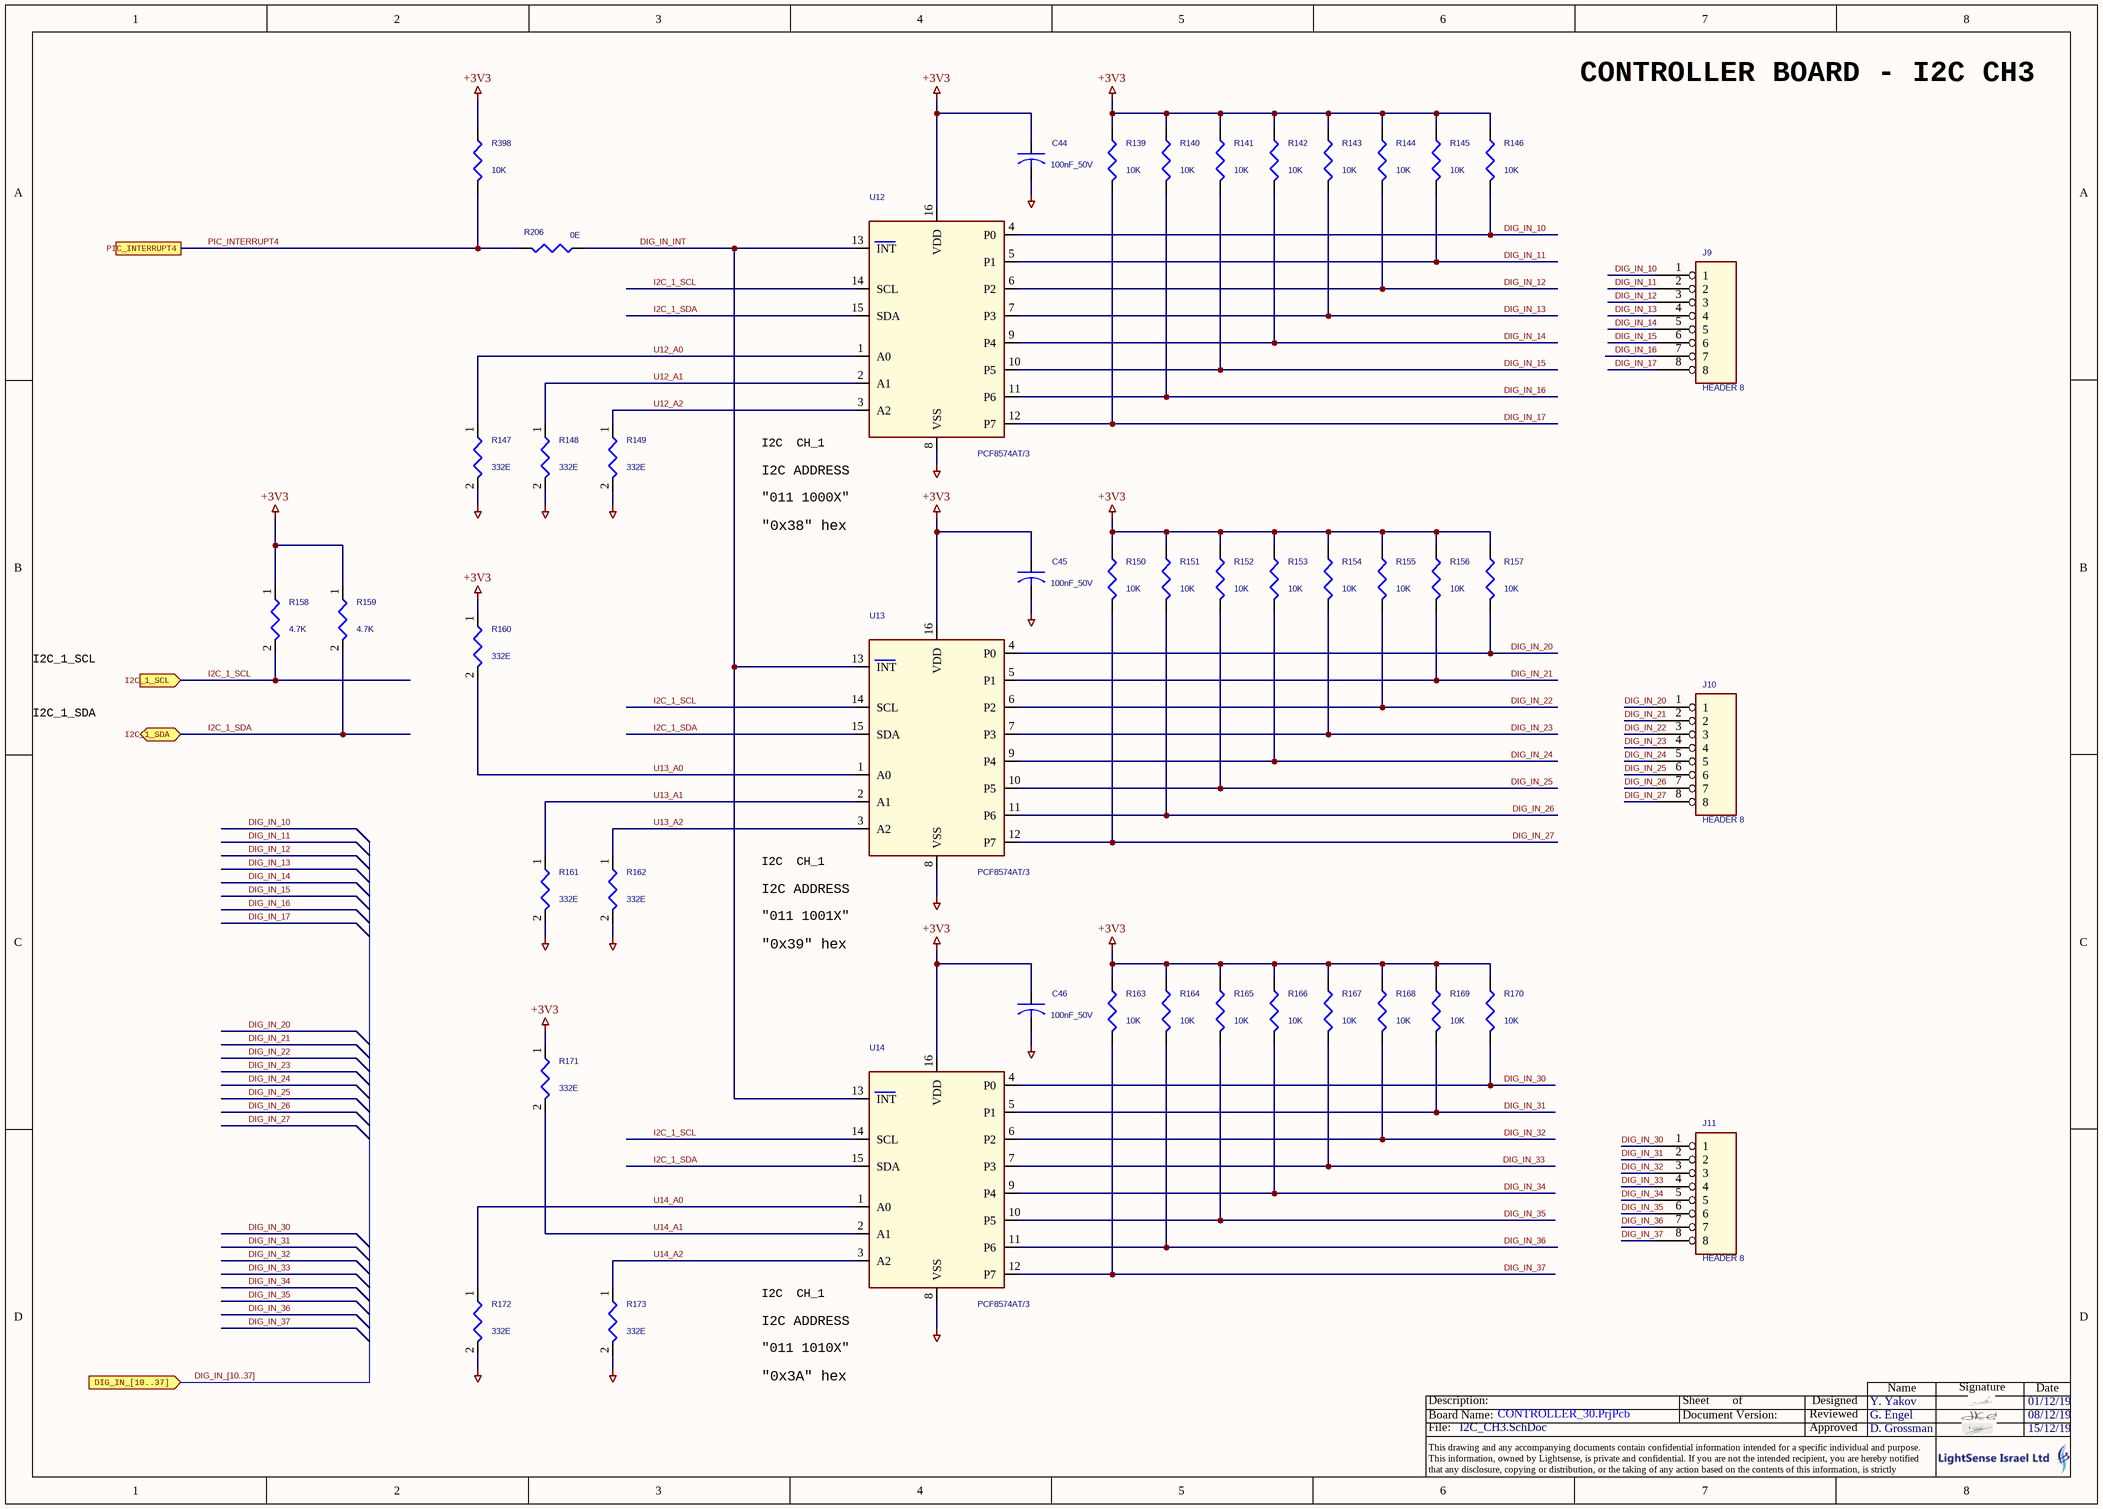
[diagram p17: I2C_CH3.SchDoc]

### Parts
C44  100nF_50V  [0603]
C45  100nF_50V  [0603]
C46  100nF_50V  [0603]
J9  HEADER 8  [TH_8PIN_100mil]
J10  HEADER 8  [TH_8PIN_100mil]
J11  HEADER 8  [TH_8PIN_100mil]
R139  10K  [0603]
R140  10K  [0603]
R141  10K  [0603]
R142  10K  [0603]
R143  10K  [0603]
R144  10K  [0603]
R145  10K  [0603]
R146  10K  [0603]
R147  332E  [R0603]
R148  332E  [R0603]
R149  332E  [R0603]
R150  10K  [0603]
R151  10K  [0603]
R152  10K  [0603]
R153  10K  [0603]
R154  10K  [0603]
R155  10K  [0603]
R156  10K  [0603]
R157  10K  [0603]
R158  4.7K  [R0603]
R159  4.7K  [R0603]
R160  332E  [R0603]
R161  332E  [R0603]
R162  332E  [R0603]
R163  10K  [0603]
R164  10K  [0603]
R165  10K  [0603]
R166  10K  [0603]
R167  10K  [0603]
R168  10K  [0603]
R169  10K  [0603]
R170  10K  [0603]
R171  332E  [R0603]
R172  332E  [R0603]
R173  332E  [R0603]
R206  0E  [0805R]
R398  10K  [0603]
U12  PCF8574AT/3  [SO_16]
U13  PCF8574AT/3  [SO_16]
U14  PCF8574AT/3  [SO_16]

### Ports
DIG_IN_[10..37] (in), I2C_1_SCL (in), I2C_1_SDA (bidir), PIC_INTERRUPT4

### Nets
+3V3: C44.1 C45.1 C46.1 R139.1 R140.1 R141.1 R142.1 R143.1 R144.1 R145.1 R146.1 R150.1 R151.1 R152.1 R153.1 R154.1 R155.1 R156.1 R157.1 R158.1 R159.1 R160.1 R163.1 R164.1 R165.1 R166.1 R167.1 R168.1 R169.1 R170.1 R171.1 R398.1 U12.16(VDD) U13.16(VDD) U14.16(VDD)
GND_CPU: C44.2 C45.2 C46.2 R147.2 R148.2 R149.2 R161.2 R162.2 R172.2 R173.2 U12.8(VSS) U13.8(VSS) U14.8(VSS)
DIG_IN_10: J9.1 R146.2 U12.4(P0)
DIG_IN_11: J9.2 R145.2 U12.5(P1)
DIG_IN_12: J9.3 R144.2 U12.6(P2)
DIG_IN_13: J9.4 R143.2 U12.7(P3)
DIG_IN_14: J9.5 R142.2 U12.9(P4)
DIG_IN_15: J9.6 R141.2 U12.10(P5)
DIG_IN_16: J9.7 R140.2 U12.11(P6)
DIG_IN_17: J9.8 R139.2 U12.12(P7)
DIG_IN_20: J10.1 R157.2 U13.4(P0)
DIG_IN_21: J10.2 R156.2 U13.5(P1)
DIG_IN_22: J10.3 R155.2 U13.6(P2)
DIG_IN_23: J10.4 R154.2 U13.7(P3)
DIG_IN_24: J10.5 R153.2 U13.9(P4)
DIG_IN_25: J10.6 R152.2 U13.10(P5)
DIG_IN_26: J10.7 R151.2 U13.11(P6)
DIG_IN_27: J10.8 R150.2 U13.12(P7)
DIG_IN_30: J11.1 R170.2 U14.4(P0)
DIG_IN_31: J11.2 R169.2 U14.5(P1)
DIG_IN_32: J11.3 R168.2 U14.6(P2)
DIG_IN_33: J11.4 R167.2 U14.7(P3)
DIG_IN_34: J11.5 R166.2 U14.9(P4)
DIG_IN_35: J11.6 R165.2 U14.10(P5)
DIG_IN_36: J11.7 R164.2 U14.11(P6)
DIG_IN_37: J11.8 R163.2 U14.12(P7)
DIG_IN_INT: R206.1 U12.13(INT) U13.13(INT) U14.13(INT)
I2C_1_SCL: R158.2 U12.14(SCL) U13.14(SCL) U14.14(SCL) ; port I2C_1_SCL
I2C_1_SDA: R159.2 U12.15(SDA) U13.15(SDA) U14.15(SDA) ; port I2C_1_SDA
PIC_INTERRUPT4: R206.2 R398.2 ; port PIC_INTERRUPT4
U12_A0: R147.1 U12.1(A0)
U12_A1: R148.1 U12.2(A1)
U12_A2: R149.1 U12.3(A2)
U13_A0: R160.2 U13.1(A0)
U13_A1: R161.1 U13.2(A1)
U13_A2: R162.1 U13.3(A2)
U14_A0: R172.1 U14.1(A0)
U14_A1: R171.2 U14.2(A1)
U14_A2: R173.1 U14.3(A2)

### Buses and harness runs
bus DIG_IN_[10..37] = port DIG_IN_[10..37]

### Notes on the sheet
- CONTROLLER BOARD - I2C CH3
- (near U12) I2C  CH_1
- (near U12) I2C ADDRESS
- "011 1000X"
- "0x38" hex
- I2C_1_SDA
- I2C_1_SCL
- (near U13) I2C  CH_1
- (near U13) I2C ADDRESS
- "011 1001X"
- "0x39" hex
- (near U14) I2C  CH_1
- (near U14) I2C ADDRESS
- "0x3A" hex
- "011 1010X"
- Name
- Signature
- Date
- File:
- Board Name:
- Description:
- Document Version:
- Sheet
- of
- Approved
- Reviewed
- Designed
- This drawing and any accompanying documents contain confidential information intended for a specific individual and purpose.
  This information, owned by Lightsense, is private and confidential. If you are not the intended recipient, you are hereby notified that any disclosure, copying or distribution, or the taking of any action based on the contents of this information, is strictly prohibited.

### Library data of the parts
C44-C46 = C: as C1 on sheet ANALOG_INPUT
R139-R146 R150-R157 R163-R170 = R_Dup1: MFG: YAGEO; MFG_PN: RC0603FR-0710K0L
R147-R149 R161 = R: MFG: YAGEO; MFG_PN: RC0603FR-07332RL
R158-R160 R162 R171-R173 = R: MFG_PN: RC0603FR-07332RL; MFG: YAGEO
R206 = R_Dup1: MFG: YAGEO; MFG_PN: RC0603FR-0710R0L
R398 = R_Dup1: MFG_PN: RC0603FR-0710K0L; MFG: YAGEO
U12 U13 = PCF8574_0: PORT I2C, 8Bit, SO_16; MFG: NXP; MFG_PN: PCF8574AT/3
U14 = PCF8574_0: PORT I2C, 8Bit, SO16; MFG: NXP; MFG_PN: PCF8574AT/3

## Sheet INT_CONN.SchDoc
size A3; ApprovedBy: D. Grossman; CheckedBy: G. Engel; Author: Y. Yakov; CompanyName: LightSense; DrawnBy: Y. Yakov; Engineer: Y.Yakov; Organization: LightSense
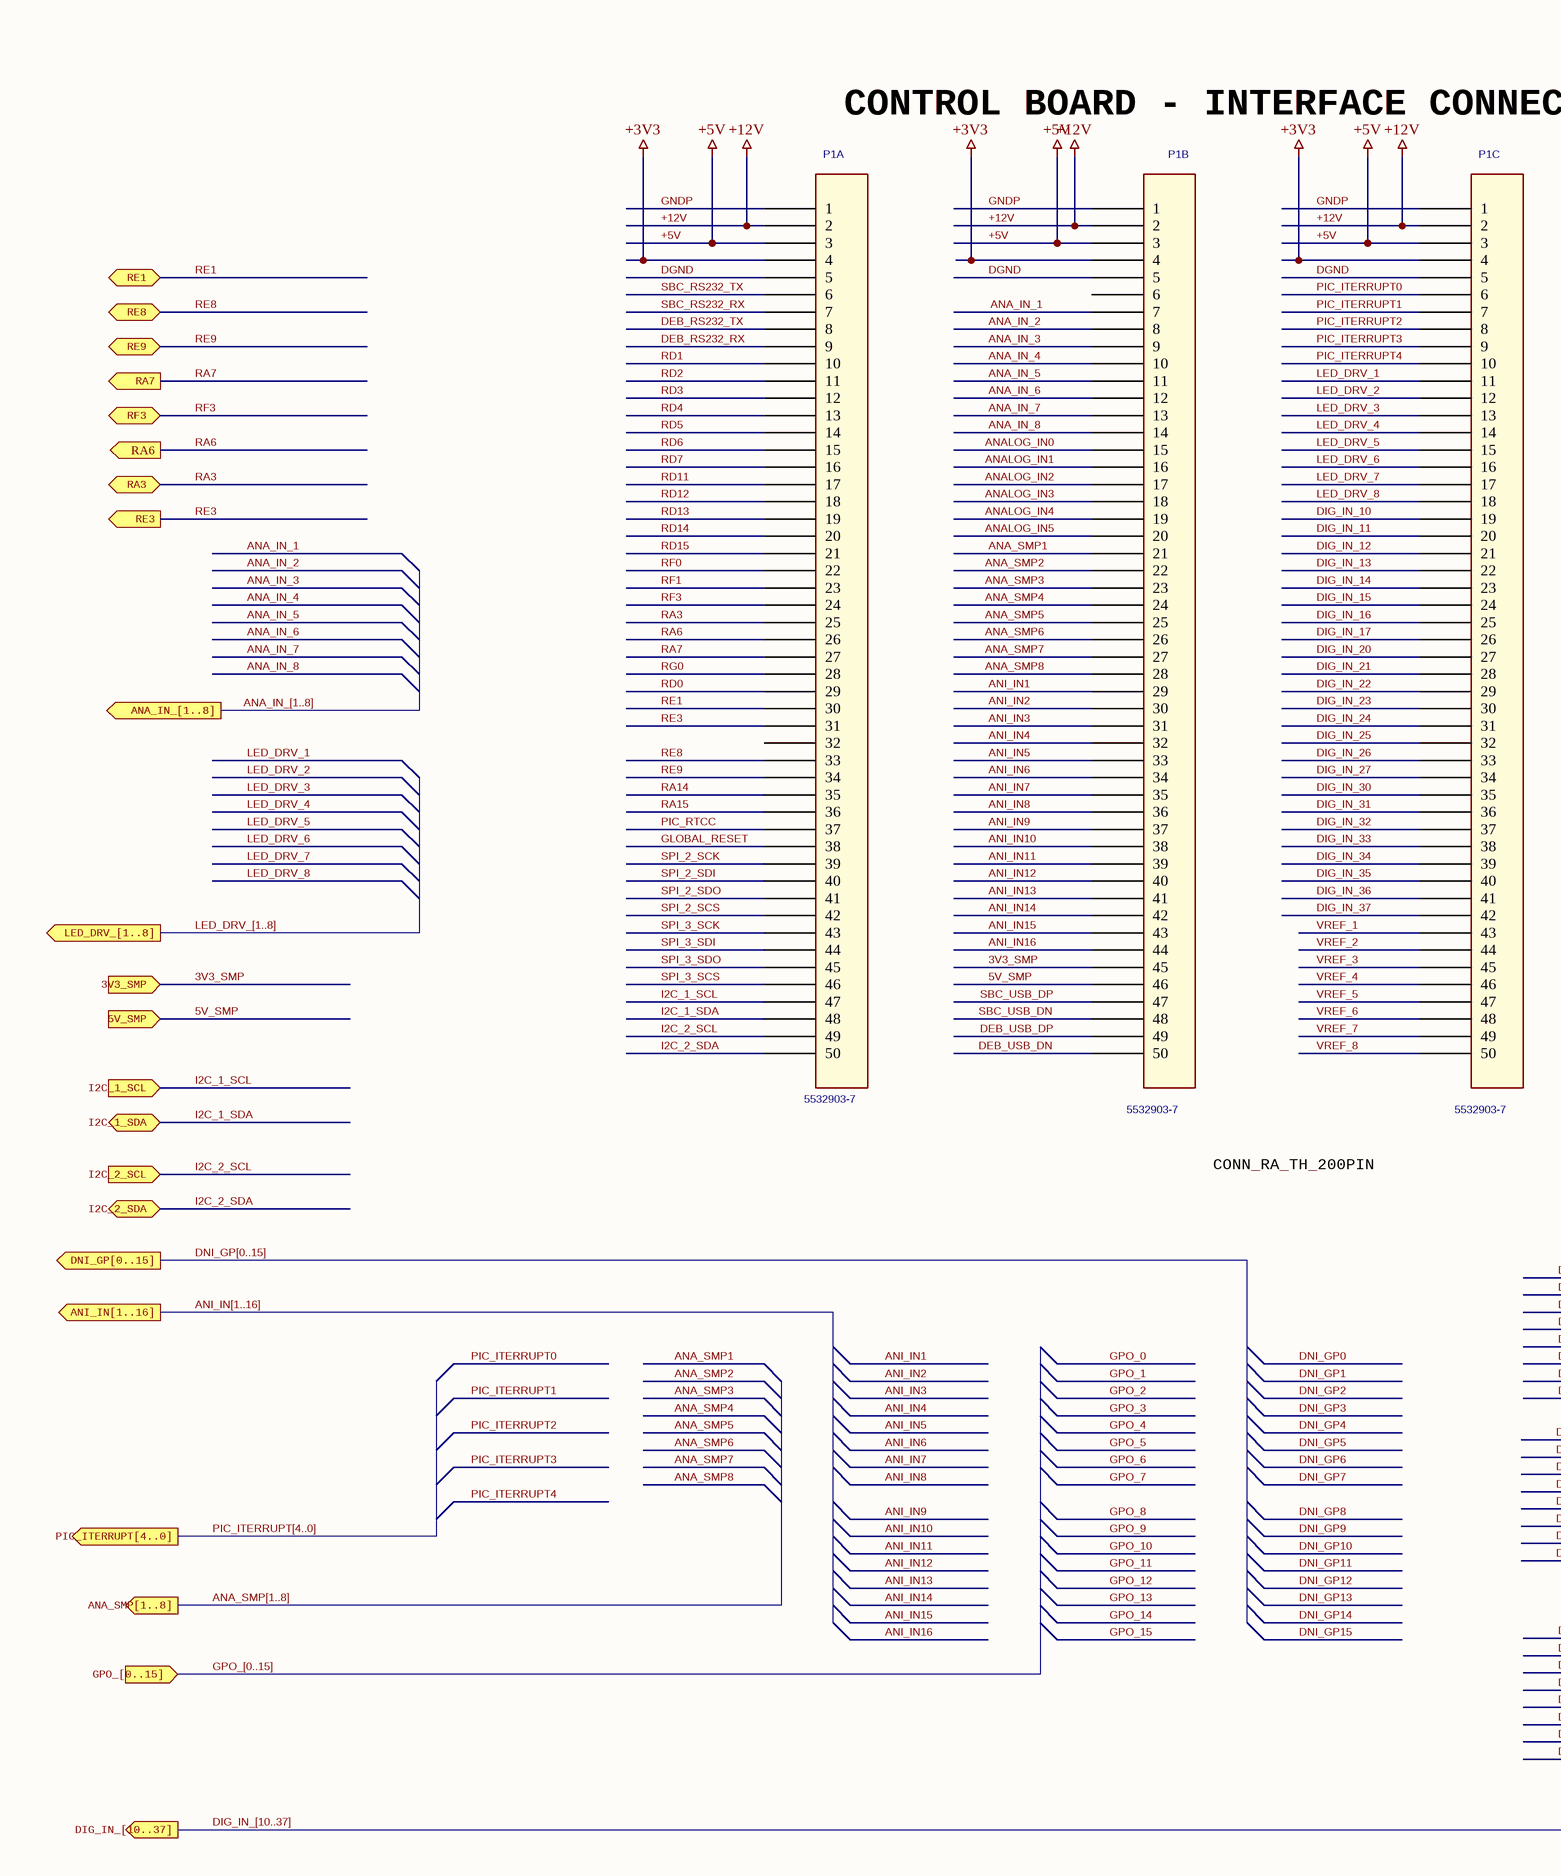
[diagram p18: INT_CONN.SchDoc, left]
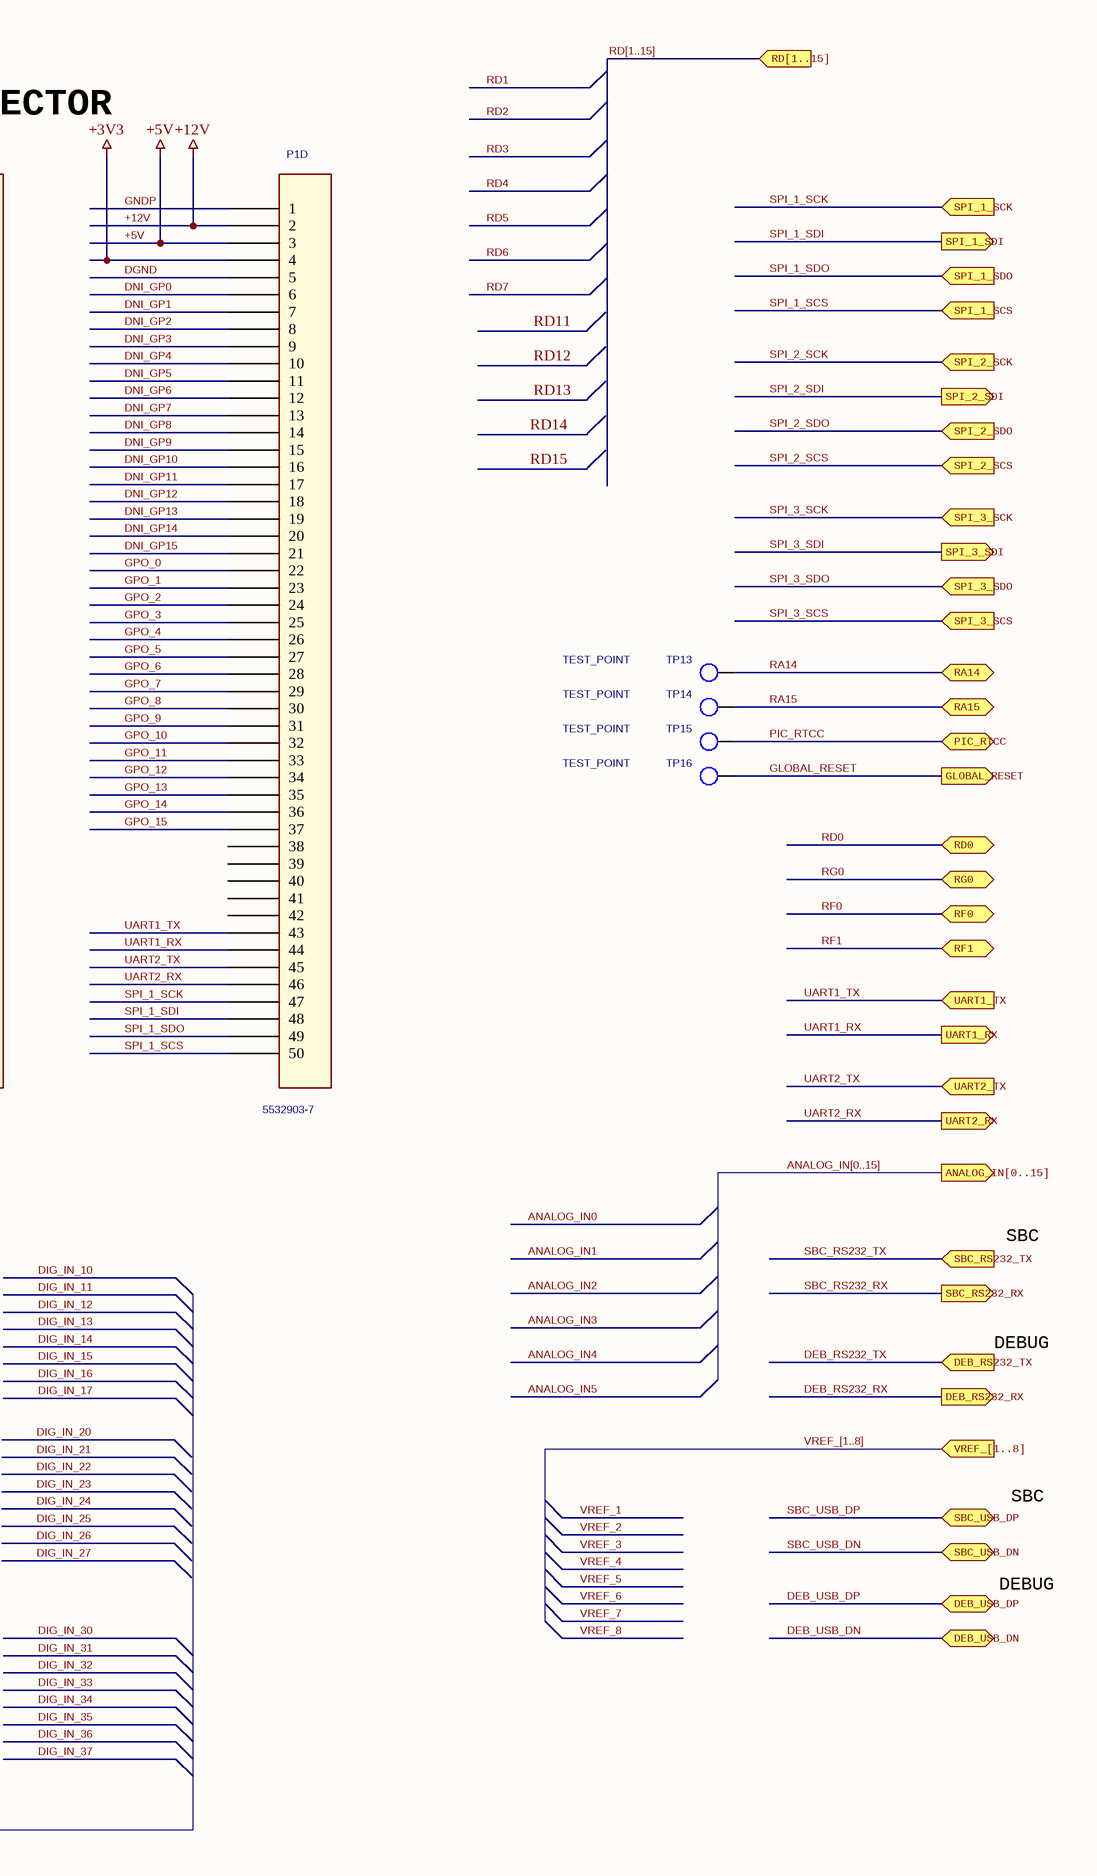
[diagram p19: INT_CONN.SchDoc, right]

### Parts
P1  5532903-7  [TH_4X50_100mil]  (parts A,B,C,D of 4)
TP13  TEST_POINT  [TH_1mm]
TP14  TEST_POINT  [TH_1mm]
TP15  TEST_POINT  [TH_1mm]
TP16  TEST_POINT  [TH_1mm]

### Ports
3V3_SMP (in), 5V_SMP (in), ANA_IN_[1..8] (out), ANA_SMP[1..8] (out), ANALOG_IN[0..15] (out), ANI_IN[1..16] (out), DEB_RS232_RX (out), DEB_RS232_TX (in), DEB_USB_DN (bidir), DEB_USB_DP (bidir), DIG_IN_[10..37] (out), DNI_GP[0..15] (out), GLOBAL_RESET (out), GPO_[0..15] (in), I2C_1_SCL (in), I2C_1_SDA (bidir), I2C_2_SCL (in), I2C_2_SDA (bidir), LED_DRV_[1..8] (out), PIC_ITERRUPT[4..0] (out), PIC_RTCC (bidir), RA3 (bidir), RA6 (out), RA7 (out), RA14 (bidir), RA15 (bidir), RD0 (bidir), RD[1..15] (in), RE1 (bidir), RE3 (out), RE8 (bidir), RE9 (bidir), RF0 (bidir), RF1 (bidir), RF3 (bidir), RG0 (bidir), SBC_RS232_RX (out), SBC_RS232_TX (in), SBC_USB_DN (bidir), SBC_USB_DP (bidir), SPI_1_SCK (in), SPI_1_SCS (in), SPI_1_SDI (out), SPI_1_SDO (in), SPI_2_SCK (in), SPI_2_SCS (in), SPI_2_SDI (out), SPI_2_SDO (in), SPI_3_SCK (in), SPI_3_SCS (in), SPI_3_SDI (out), SPI_3_SDO (in), UART1_RX (out), UART1_TX (in), UART2_RX (out), UART2_TX (in), VREF_[1..8] (in)

### Nets
+3V3: P1.4A(4) P1.4B(4) P1.4C(4) P1.4D(4)
+5V: P1.3A(3) P1.3B(3) P1.3C(3) P1.3D(3)
+12V: P1.2A(2) P1.2B(2) P1.2C(2) P1.2D(2)
3V3_SMP: P1.45B(45) ; port 3V3_SMP
5V_SMP: P1.46B(46) ; port 5V_SMP
ANA_IN_1: P1.7B(7)
ANA_IN_2: P1.8B(8)
ANA_IN_3: P1.9B(9)
ANA_IN_4: P1.10B(10)
ANA_IN_5: P1.11B(11)
ANA_IN_6: P1.12B(12)
ANA_IN_7: P1.13B(13)
ANA_IN_8: P1.14B(14)
ANA_SMP1: P1.21B(21)
ANA_SMP2: P1.22B(22)
ANA_SMP3: P1.23B(23)
ANA_SMP4: P1.24B(24)
ANA_SMP5: P1.25B(25)
ANA_SMP6: P1.26B(26)
ANA_SMP7: P1.27B(27)
ANA_SMP8: P1.28B(28)
ANALOG_IN0: P1.15B(15)
ANALOG_IN1: P1.16B(16)
ANALOG_IN2: P1.17B(17)
ANALOG_IN3: P1.18B(18)
ANALOG_IN4: P1.19B(19)
ANALOG_IN5: P1.20B(20)
ANI_IN1: P1.29B(29)
ANI_IN2: P1.30B(30)
ANI_IN3: P1.31B(31)
ANI_IN4: P1.32B(32)
ANI_IN5: P1.33B(33)
ANI_IN6: P1.34B(34)
ANI_IN7: P1.35B(35)
ANI_IN8: P1.36B(36)
ANI_IN9: P1.37B(37)
ANI_IN10: P1.38B(38)
ANI_IN11: P1.39B(39)
ANI_IN12: P1.40B(40)
ANI_IN13: P1.41B(41)
ANI_IN14: P1.42B(42)
ANI_IN15: P1.43B(43)
ANI_IN16: P1.44B(44)
DEB_RS232_RX: P1.9A(9) ; port DEB_RS232_RX
DEB_RS232_TX: P1.8A(8) ; port DEB_RS232_TX
DEB_USB_DN: P1.50B(50) ; port DEB_USB_DN
DEB_USB_DP: P1.49B(49) ; port DEB_USB_DP
DGND: P1.5A(5) P1.5B(5) P1.5C(5) P1.5D(5)
DIG_IN_10: P1.19C(19)
DIG_IN_11: P1.20C(20)
DIG_IN_12: P1.21C(21)
DIG_IN_13: P1.22C(22)
DIG_IN_14: P1.23C(23)
DIG_IN_15: P1.24C(24)
DIG_IN_16: P1.25C(25)
DIG_IN_17: P1.26C(26)
DIG_IN_20: P1.27C(27)
DIG_IN_21: P1.28C(28)
DIG_IN_22: P1.29C(29)
DIG_IN_23: P1.30C(30)
DIG_IN_24: P1.31C(31)
DIG_IN_25: P1.32C(32)
DIG_IN_26: P1.33C(33)
DIG_IN_27: P1.34C(34)
DIG_IN_30: P1.35C(35)
DIG_IN_31: P1.36C(36)
DIG_IN_32: P1.37C(37)
DIG_IN_33: P1.38C(38)
DIG_IN_34: P1.39C(39)
DIG_IN_35: P1.40C(40)
DIG_IN_36: P1.41C(41)
DIG_IN_37: P1.42C(42)
DNI_GP0: P1.6D(6)
DNI_GP1: P1.7D(7)
DNI_GP2: P1.8D(8)
DNI_GP3: P1.9D(9)
DNI_GP4: P1.10D(10)
DNI_GP5: P1.11D(11)
DNI_GP6: P1.12D(12)
DNI_GP7: P1.13D(13)
DNI_GP8: P1.14D(14)
DNI_GP9: P1.15D(15)
DNI_GP10: P1.16D(16)
DNI_GP11: P1.17D(17)
DNI_GP12: P1.18D(18)
DNI_GP13: P1.19D(19)
DNI_GP14: P1.20D(20)
DNI_GP15: P1.21D(21)
GLOBAL_RESET: P1.38A(38) TP16.1(TP) ; port GLOBAL_RESET
GNDP: P1.1A(1) P1.1B(1) P1.1C(1) P1.1D(1)
GPO_0: P1.22D(22)
GPO_1: P1.23D(23)
GPO_2: P1.24D(24)
GPO_3: P1.25D(25)
GPO_4: P1.26D(26)
GPO_5: P1.27D(27)
GPO_6: P1.28D(28)
GPO_7: P1.29D(29)
GPO_8: P1.30D(30)
GPO_9: P1.31D(31)
GPO_10: P1.32D(32)
GPO_11: P1.33D(33)
GPO_12: P1.34D(34)
GPO_13: P1.35D(35)
GPO_14: P1.36D(36)
GPO_15: P1.37D(37)
I2C_1_SCL: P1.47A(47) ; port I2C_1_SCL
I2C_1_SDA: P1.48A(48) ; port I2C_1_SDA
I2C_2_SCL: P1.49A(49) ; port I2C_2_SCL
I2C_2_SDA: P1.50A(50) ; port I2C_2_SDA
LED_DRV_1: P1.11C(11)
LED_DRV_2: P1.12C(12)
LED_DRV_3: P1.13C(13)
LED_DRV_4: P1.14C(14)
LED_DRV_5: P1.15C(15)
LED_DRV_6: P1.16C(16)
LED_DRV_7: P1.17C(17)
LED_DRV_8: P1.18C(18)
PIC_ITERRUPT0: P1.6C(6)
PIC_ITERRUPT1: P1.7C(7)
PIC_ITERRUPT2: P1.8C(8)
PIC_ITERRUPT3: P1.9C(9)
PIC_ITERRUPT4: P1.10C(10)
PIC_RTCC: P1.37A(37) TP15.1(TP) ; port PIC_RTCC
RA3: P1.25A(25) ; port RA3
RA6: P1.26A(26) ; port RA6
RA7: P1.27A(27) ; port RA7
RA14: P1.35A(35) TP13.1(TP) ; port RA14
RA15: P1.36A(36) TP14.1(TP) ; port RA15
RD0: P1.29A(29) ; port RD0
RD1: P1.10A(10)
RD2: P1.11A(11)
RD3: P1.12A(12)
RD4: P1.13A(13)
RD5: P1.14A(14)
RD6: P1.15A(15)
RD7: P1.16A(16)
RD11: P1.17A(17)
RD12: P1.18A(18)
RD13: P1.19A(19)
RD14: P1.20A(20)
RD15: P1.21A(21)
RE1: P1.30A(30) ; port RE1
RE3: P1.31A(31) ; port RE3
RE8: P1.33A(33) ; port RE8
RE9: P1.34A(34) ; port RE9
RF0: P1.22A(22) ; port RF0
RF1: P1.23A(23) ; port RF1
RF3: P1.24A(24) ; port RF3
RG0: P1.28A(28) ; port RG0
SBC_RS232_RX: P1.7A(7) ; port SBC_RS232_RX
SBC_RS232_TX: P1.6A(6) ; port SBC_RS232_TX
SBC_USB_DN: P1.48B(48) ; port SBC_USB_DN
SBC_USB_DP: P1.47B(47) ; port SBC_USB_DP
SPI_1_SCK: P1.47D(47) ; port SPI_1_SCK
SPI_1_SCS: P1.50D(50) ; port SPI_1_SCS
SPI_1_SDI: P1.48D(48) ; port SPI_1_SDI
SPI_1_SDO: P1.49D(49) ; port SPI_1_SDO
SPI_2_SCK: P1.39A(39) ; port SPI_2_SCK
SPI_2_SCS: P1.42A(42) ; port SPI_2_SCS
SPI_2_SDI: P1.40A(40) ; port SPI_2_SDI
SPI_2_SDO: P1.41A(41) ; port SPI_2_SDO
SPI_3_SCK: P1.43A(43) ; port SPI_3_SCK
SPI_3_SCS: P1.46A(46) ; port SPI_3_SCS
SPI_3_SDI: P1.44A(44) ; port SPI_3_SDI
SPI_3_SDO: P1.45A(45) ; port SPI_3_SDO
UART1_RX: P1.44D(44) ; port UART1_RX
UART1_TX: P1.43D(43) ; port UART1_TX
UART2_RX: P1.46D(46) ; port UART2_RX
UART2_TX: P1.45D(45) ; port UART2_TX
VREF_1: P1.43C(43)
VREF_2: P1.44C(44)
VREF_3: P1.45C(45)
VREF_4: P1.46C(46)
VREF_5: P1.47C(47)
VREF_6: P1.48C(48)
VREF_7: P1.49C(49)
VREF_8: P1.50C(50)

Not connected (* = marked no-connect by the designer): P1 6B(6) 32A(32) 38D(38) 39D(39) 40D(40) 41D(41) 42D(42)

### Buses and harness runs
bus ANA_IN_[1..8] = port ANA_IN_[1..8]
bus ANA_SMP[1..8] = port ANA_SMP[1..8]
bus ANALOG_IN[0..15] = port ANALOG_IN[0..15]
bus ANI_IN[1..16] = port ANI_IN[1..16]
bus DIG_IN_[10..37] = port DIG_IN_[10..37]
bus DNI_GP[0..15] = port DNI_GP[0..15]
bus GPO_[0..15] = port GPO_[0..15]
bus LED_DRV_[1..8] = port LED_DRV_[1..8]
bus PIC_ITERRUPT[4..0] = port PIC_ITERRUPT[4..0]
bus RD[1..15] = port RD[1..15]
bus VREF_[1..8] = port VREF_[1..8]

### Notes on the sheet
- CONTROL BOARD - INTERFACE CONNECTOR
- CONN_RA_TH_200PIN
- SBC
- DEBUG
- Name
- Signature
- Date
- File:
- Board Name:
- Description:
- Document Version:
- Sheet
- of
- Approved
- Reviewed
- Designed
- This drawing and any accompanying documents contain confidential information intended for a specific individual and purpose.
  This information, owned by Lightsense, is private and confidential. If you are not the intended recipient, you are hereby notified that any disclosure, copying or distribution, or the taking of any action based on the contents of this information, is strictly prohibited.

### Library data of the parts
P1 = CONN_RA_TH_200PIN: System: Connector
TP13-TP16 = T POINT R_Dup1

## Sheet I2C_CH1.SchDoc
size A3; ApprovedBy: D. Grossman; CheckedBy: G. Engel; Author: Y. Yakov; CompanyName: LightSense; DrawnBy: Y. Yakov; Engineer: Y.Yakov; Organization: LightSense
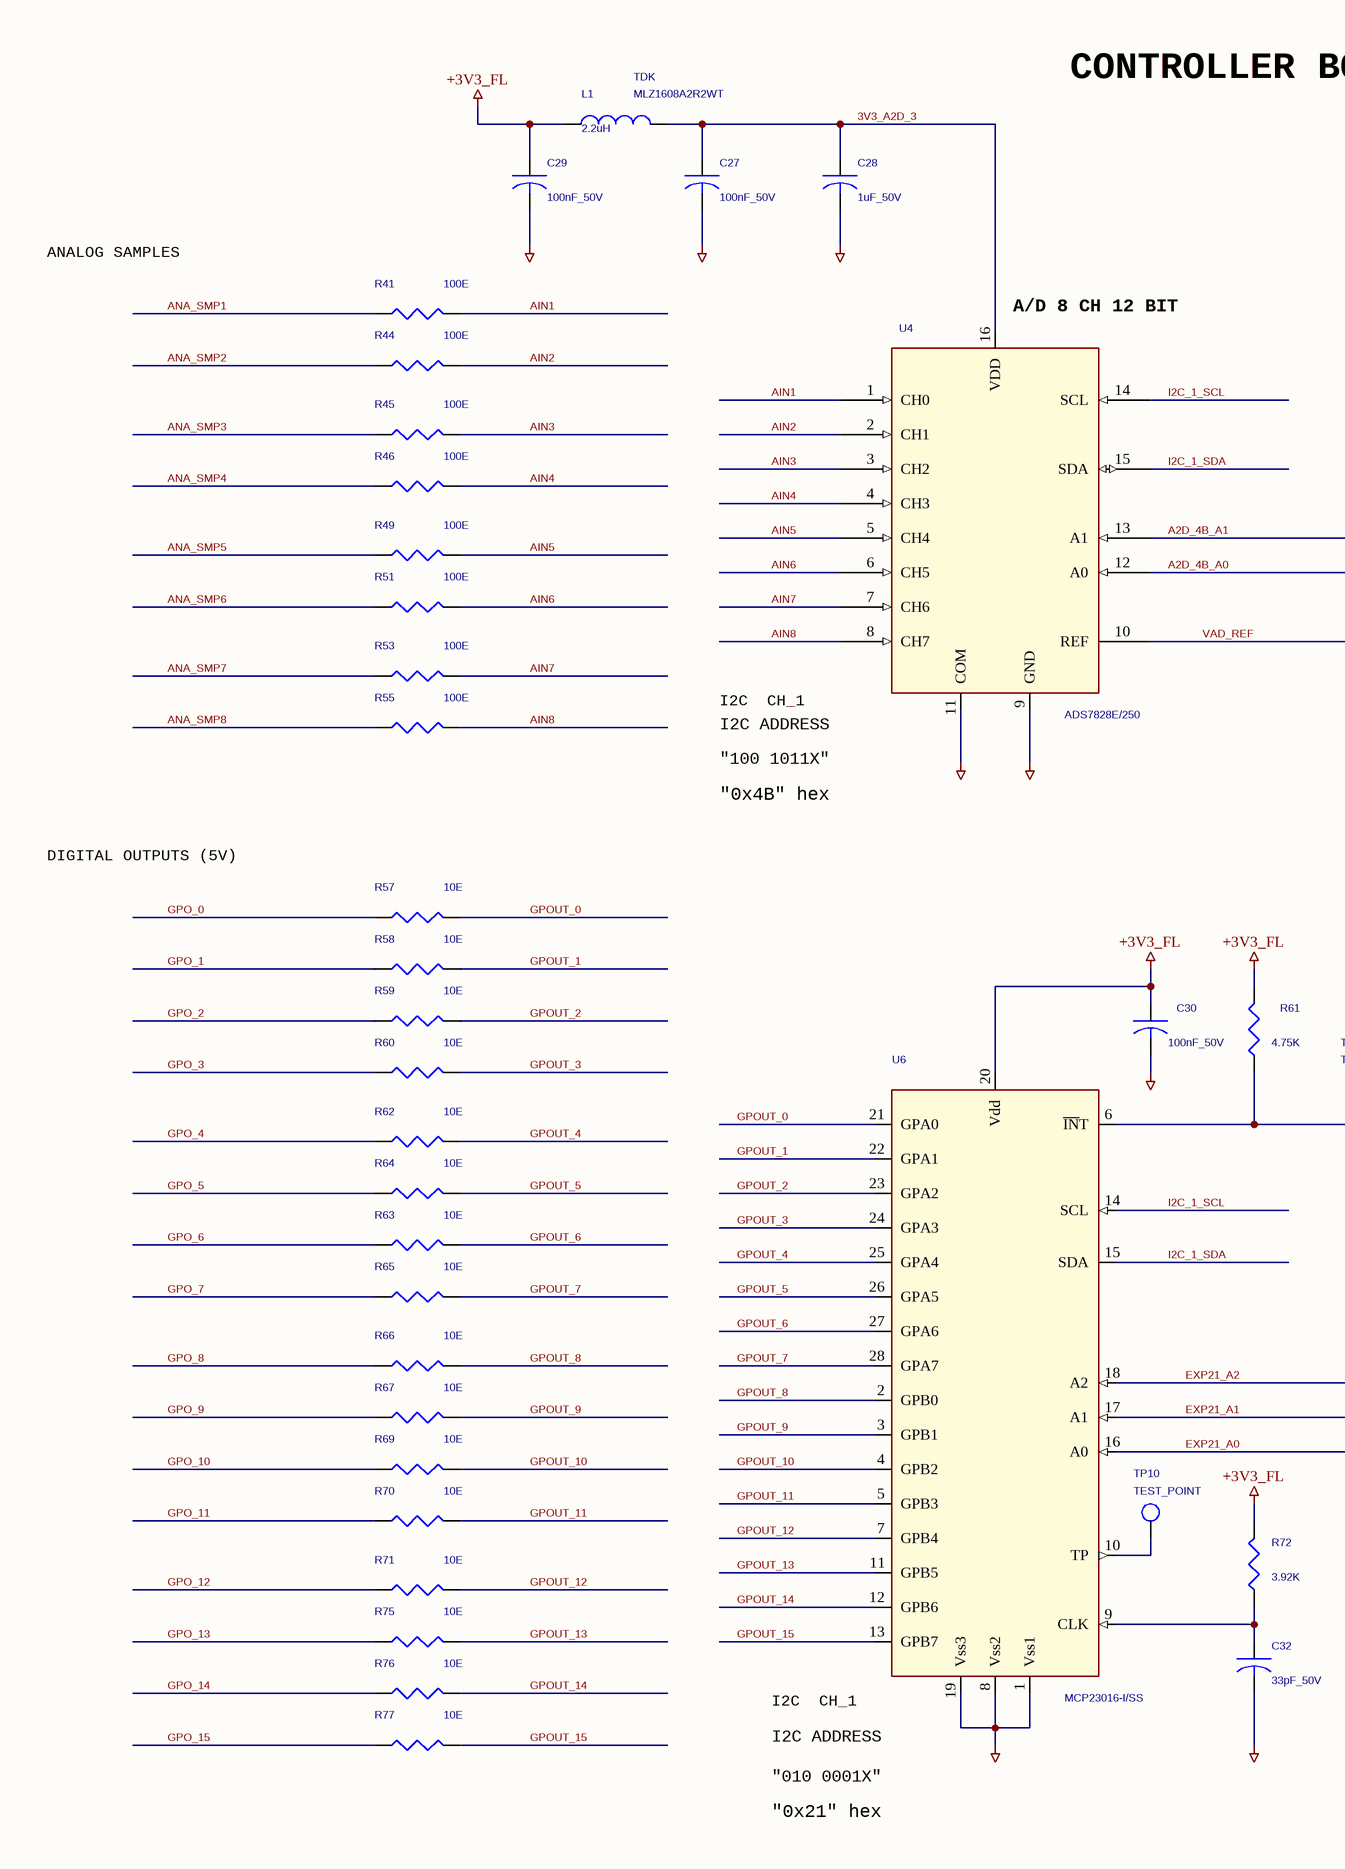
[diagram p20: I2C_CH1.SchDoc, left]
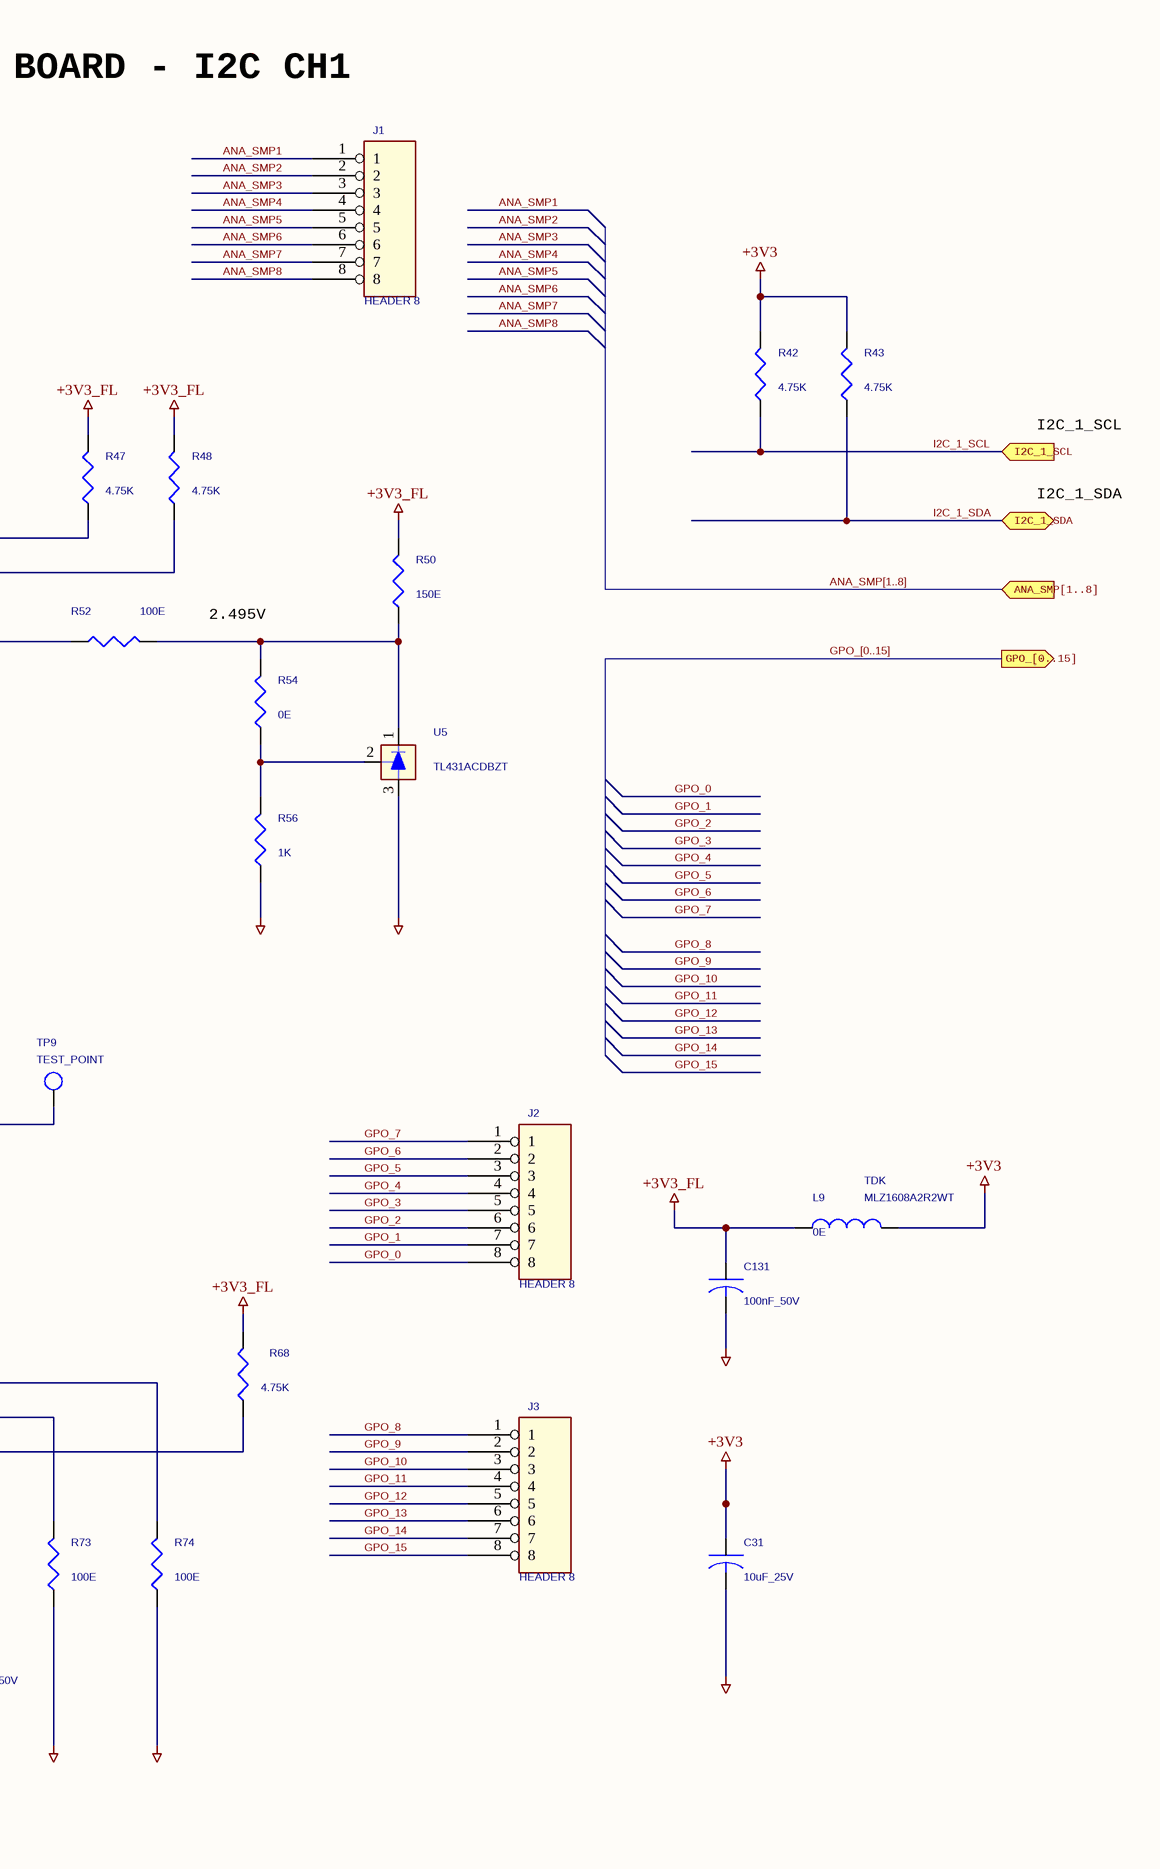
[diagram p21: I2C_CH1.SchDoc, right]

### Parts
C27  100nF_50V  [0603]
C28  1uF_50V  [0805]
C29  100nF_50V  [0603]
C30  100nF_50V  [0603]
C31  10uF_25V  [1206]
C32  33pF_50V  [0603]
C131  100nF_50V  [0603]
J1  HEADER 8  [TH_8PIN_100mil]
J2  HEADER 8  [TH_8PIN_100mil]
J3  HEADER 8  [TH_8PIN_100mil]
L1  2.2uH  MFG_PN: MLZ1608A2R2WT  MFG: TDK  [0603]
L9  0E  MFG: TDK  MFG_PN: MLZ1608A2R2WT  [0603]
R41  100E  [0603]
R42  4.75K  [0603]
R43  4.75K  [0603]
R44  100E  [0603]
R45  100E  [0603]
R46  100E  [0603]
R47  4.75K  [0603]
R48  4.75K  [0603]
R49  100E  [0603]
R50  150E  [0603]
R51  100E  [0603]
R52  100E  [0603]
R53  100E  [0603]
R54  0E  [0603]
R55  100E  [0603]
R56  1K  [0603]
R57  10E  [0603]
R58  10E  [0603]
R59  10E  [0603]
R60  10E  [0603]
R61  4.75K  [0603]
R62  10E  [0603]
R63  10E  [0603]
R64  10E  [0603]
R65  10E  [0603]
R66  10E  [0603]
R67  10E  [0603]
R68  4.75K  [0603]
R69  10E  [0603]
R70  10E  [0603]
R71  10E  [0603]
R72  3.92K  [0603]
R73  100E  [0603]
R74  100E  [0603]
R75  10E  [0603]
R76  10E  [0603]
R77  10E  [0603]
TP9  TEST_POINT  [TH_1mm]
TP10  TEST_POINT  [TH_1mm]
U4  ADS7828E/250  [TSSOP_16]
U5  TL431ACDBZT  [SOT_23]
U6  MCP23016-I/SS  [SSOP_28]

### Ports
ANA_SMP[1..8] (in), GPO_[0..15] (out), I2C_1_SCL (in), I2C_1_SDA (bidir)

### Nets
+3V3: C31.1 L9.2 R42.2 R43.2
+3V3_FL: C29.1 C30.1 C131.1 L1.1 L9.1 R47.2 R48.2 R50.2 R61.2 R68.2 R72.2 U6.20(Vdd)
GND_CPU: C27.2 C28.2 C29.2 C30.2 C31.2 C32.2 C131.2 R56.1 R73.1 R74.1 U4.9(GND) U4.11(COM) U5.3(ANODA) U6.1(Vss1) U6.8(Vss2) U6.19(Vss3)
3V3_A2D_3: C27.1 C28.1 L1.2 U4.16(VDD)
A2D_4B_A0: R48.1 U4.12(A0)
A2D_4B_A1: R47.1 U4.13(A1)
AIN1: R41.1 U4.1(CH0)
AIN2: R44.1 U4.2(CH1)
AIN3: R45.1 U4.3(CH2)
AIN4: R46.1 U4.4(CH3)
AIN5: R49.1 U4.5(CH4)
AIN6: R51.1 U4.6(CH5)
AIN7: R53.1 U4.7(CH6)
AIN8: R55.1 U4.8(CH7)
ANA_SMP1: J1.1 R41.2
ANA_SMP2: J1.2 R44.2
ANA_SMP3: J1.3 R45.2
ANA_SMP4: J1.4 R46.2
ANA_SMP5: J1.5 R49.2
ANA_SMP6: J1.6 R51.2
ANA_SMP7: J1.7 R53.2
ANA_SMP8: J1.8 R55.2
EXP21_A0: R68.1 U6.16(A0)
EXP21_A1: R73.2 U6.17(A1)
EXP21_A2: R74.2 U6.18(A2)
GPO_0: J2.8 R57.2
GPO_1: J2.7 R58.2
GPO_2: J2.6 R59.2
GPO_3: J2.5 R60.2
GPO_4: J2.4 R62.2
GPO_5: J2.3 R64.2
GPO_6: J2.2 R63.2
GPO_7: J2.1 R65.2
GPO_8: J3.1 R66.2
GPO_9: J3.2 R67.2
GPO_10: J3.3 R69.2
GPO_11: J3.4 R70.2
GPO_12: J3.5 R71.2
GPO_13: J3.6 R75.2
GPO_14: J3.7 R76.2
GPO_15: J3.8 R77.2
GPOUT_0: R57.1 U6.21(GPA0)
GPOUT_1: R58.1 U6.22(GPA1)
GPOUT_2: R59.1 U6.23(GPA2)
GPOUT_3: R60.1 U6.24(GPA3)
GPOUT_4: R62.1 U6.25(GPA4)
GPOUT_5: R64.1 U6.26(GPA5)
GPOUT_6: R63.1 U6.27(GPA6)
GPOUT_7: R65.1 U6.28(GPA7)
GPOUT_8: R66.1 U6.2(GPB0)
GPOUT_9: R67.1 U6.3(GPB1)
GPOUT_10: R69.1 U6.4(GPB2)
GPOUT_11: R70.1 U6.5(GPB3)
GPOUT_12: R71.1 U6.7(GPB4)
GPOUT_13: R75.1 U6.11(GPB5)
GPOUT_14: R76.1 U6.12(GPB6)
GPOUT_15: R77.1 U6.13(GPB7)
I2C_1_SCL: R42.1 U4.14(SCL) U6.14(SCL) ; port I2C_1_SCL
I2C_1_SDA: R43.1 U4.15(SDA) U6.15(SDA) ; port I2C_1_SDA
VAD_REF: R52.2 U4.10(REF)
NetC32_1: C32.1 R72.1 U6.9(CLK)
NetR50_1: R50.1 R52.1 R54.2 U5.1(CAT)
NetR54_1: R54.1 R56.2 U5.2(Vref)
NetR61_1: R61.1 TP9.1(TP) U6.6(~{IN}T)
NetTP10_1: TP10.1(TP) U6.10(TP)

### Buses and harness runs
bus ANA_SMP[1..8] = port ANA_SMP[1..8]
bus GPO_[0..15] = port GPO_[0..15]

### Notes on the sheet
- CONTROLLER BOARD - I2C CH1
- ANALOG SAMPLES
- (near U4) A/D 8 CH 12 BIT
- I2C_1_SCL
- I2C_1_SDA
- 2.495V
- I2C ADDRESS
- I2C  CH_1
- "0x4B" hex
- "100 1011X"
- DIGITAL OUTPUTS (5V)
- (near U6) I2C ADDRESS
- (near U6) I2C  CH_1
- "0x21" hex
- "010 0001X"
- Name
- Signature
- Date
- File:
- Board Name:
- Description:
- Document Version:
- Sheet
- of
- Approved
- Reviewed
- Designed
- This drawing and any accompanying documents contain confidential information intended for a specific individual and purpose.
  This information, owned by Lightsense, is private and confidential. If you are not the intended recipient, you are hereby notified that any disclosure, copying or distribution, or the taking of any action based on the contents of this information, is strictly prohibited.

### Library data of the parts
C27 = C: as C2 on sheet ANALOG_INPUT
C28 = CAP: as C84 on sheet POWER
C29 C131 = C: as C1 on sheet ANALOG_INPUT
C30 = C: as C39 on sheet I2C_CH2
C31 = C: CAP_SMT_1206_25V_X7R_10%; MFG_PN: C1206C106K3RAC; MFG: KEMET
C32 = C: CAP_SMT_0603_50V_X7R_10%; MFG_PN: C0603C330K5RAC; MFG: KEMET
L1 L9 = INDUCTOR
R41 R44-R46 R49 R51-R53 R55 R73 R74 = R_Dup1: MFG: YAGEO; MFG_PN: RC0603FR-07100RL
R42 R48 R61 R68 = R_Dup1: MFG: YAGEO; MFG_PN: RC0603FR-074K75L
R43 R47 = R_Dup1: MFG_PN: RC0603FR-074K75L; MFG: YAGEO
R50 = R_Dup1: MFG_PN: RC0603FR-07150RL; MFG: YAGEO
R54 = R_Dup1: MFG: YAGEO; MFG_PN: RC0603FR-070R00L
R56 = R_Dup1: MFG: YAGEO; MFG_PN: RC0603FR-071K00L
R57 R58 R62 R64 = R_Dup1: MFG_PN: RC0603FR-0710R0L; MFG: YAGEO
R59 R60 R63 R65-R67 R69-R71 R75-R77 = R_Dup1: MFG: YAGEO; MFG_PN: RC0603FR-0710R0L
R72 = R_Dup1: MFG_PN: RC0603FR-073K92L; MFG: YAGEO
TP9 TP10 = T POINT R_Dup1
U4 = ADS7828E: MFG: TI; MFG_PN: ADS7828E/250
U5 = TL431ACDBZT: Part_Number: <Part_Number>; MFG: TI; MFG_PN: TL431ACDBZT
U6 = MCP23016-I/SS: MFG: MICROCHIP; MFG_PN: MCP23016-I/SS